# EAGLE design elm012 (EAGLE 4.16)

## Sheet 1 of 4
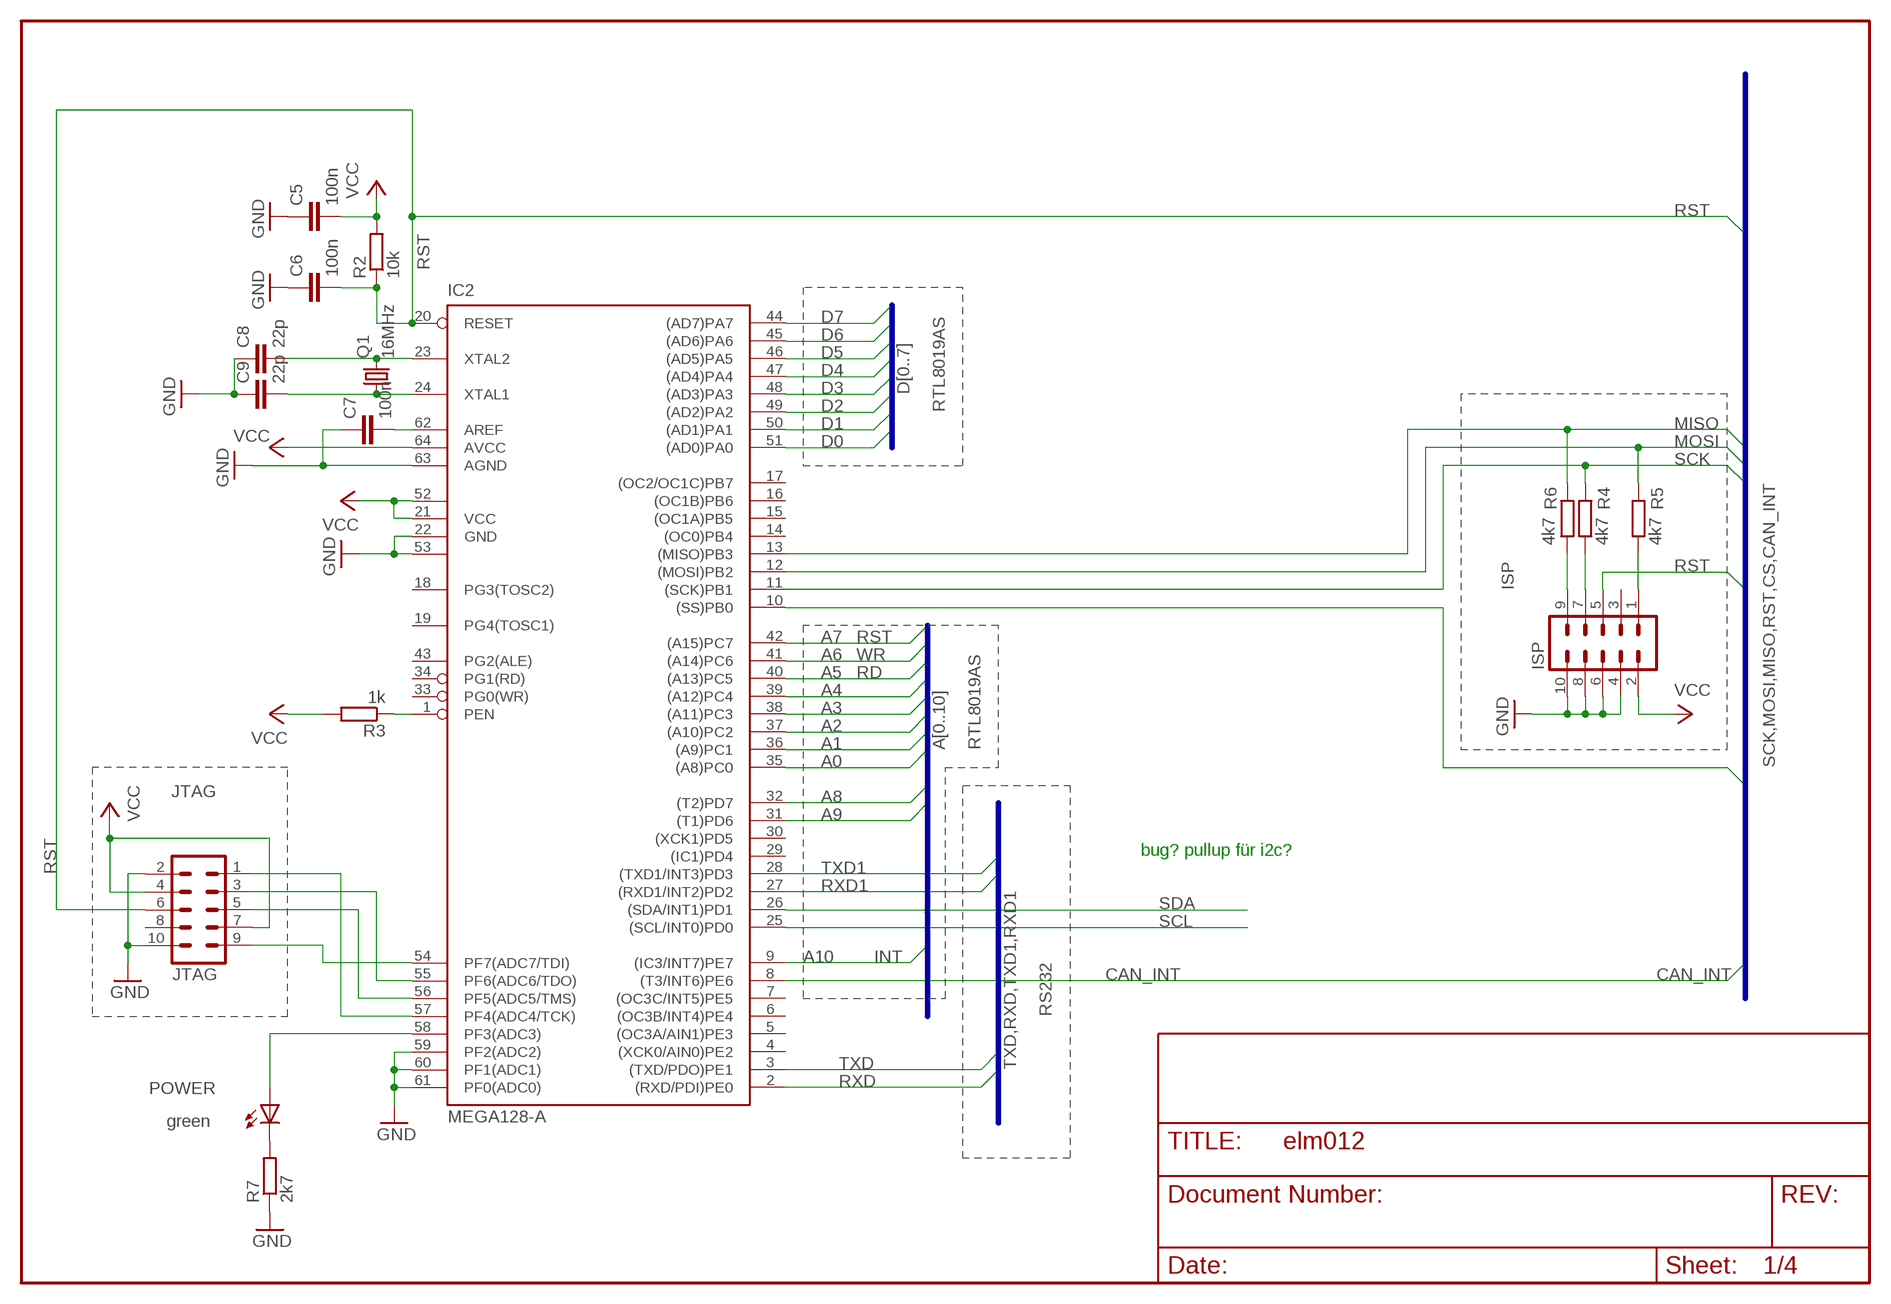
[diagram p0: schematic, sheet 1]

### Parts
C5  100n  C-EUC0603  [C0603]
C6  100n  C-EUC0603  [C0603]
C7  100n  C-EUC0603  [C0603]
C8  22p  C-EUC0603  [C0603]
C9  22p  C-EUC0603  [C0603]
IC2  MEGA128-A  [TQFP64]
ISP  MA05-2  [MA05-2]
JTAG  MA05-2  [MA05-2]
POWER  green  LED3MM  [LED3MM]
Q1  16MHz  CRYSTALHC49U-V  [HC49U-V]
R2  10k  R-EU_R0805  [R0805]
R3  1k  R-EU_R0805  [R0805]
R4  4k7  R-EU_R0805  [R0805]
R5  4k7  R-EU_R0805  [R0805]
R6  4k7  R-EU_R0805  [R0805]
R7  2k7  R-EU_R0805  [R0805]

### Nets
A0: IC2.35((A8)PC0) ; also sheet 3
A1: IC2.36((A9)PC1) ; also sheet 3
A2: IC2.37((A10)PC2) ; also sheet 3
A3: IC2.38((A11)PC3) ; also sheet 3
A4: IC2.39((A12)PC4) ; also sheet 3
A5: IC2.40((A13)PC5) ; also sheet 3
A6: IC2.41((A14)PC6) ; also sheet 3
A7: IC2.42((A15)PC7) ; also sheet 3
A8: IC2.32((T2)PD7) ; also sheet 3
A9: IC2.31((T1)PD6) ; also sheet 3
A10: IC2.9((IC3/INT7)PE7) ; also sheet 3
CAN_INT: IC2.8((T3/INT6)PE6) ; also sheet 2
CS: IC2.10((SS)PB0) ; also sheet 2
D0: IC2.51((AD0)PA0) ; also sheet 3
D1: IC2.50((AD1)PA1) ; also sheet 3
D2: IC2.49((AD2)PA2) ; also sheet 3
D3: IC2.48((AD3)PA3) ; also sheet 3
D4: IC2.47((AD4)PA4) ; also sheet 3
D5: IC2.46((AD5)PA5) ; also sheet 3
D6: IC2.45((AD6)PA6) ; also sheet 3
D7: IC2.44((AD7)PA7) ; also sheet 3
GND: C5.1 C6.1 C7.1 C8.1 C9.1 IC2.22(GND) IC2.53(GND1) IC2.59(PF2(ADC2)) IC2.60(PF1(ADC1)) IC2.61(PF0(ADC0)) IC2.63(AGND) ISP.4 ISP.6 ISP.8 ISP.10 JTAG.2 JTAG.10 R7.1 ; also sheet 2,3,4
MISO: IC2.13((MISO)PB3) R6.2 ; also sheet 2
MOSI: IC2.12((MOSI)PB2) R5.2 ; also sheet 2
N$5: C7.2 IC2.62(AREF)
N$6: C9.2 IC2.24(XTAL1) Q1.1
N$7: C8.2 IC2.23(XTAL2) Q1.2
N$22: ISP.9 R6.1
N$25: ISP.1 R5.1
N$26: IC2.1(PEN) R3.1
N$29: ISP.7 R4.1
N$31: POWER.K(C) R7.2
N$32: IC2.58(PF3(ADC3)) POWER.A
N$68: IC2.54(PF7(ADC7/TDI)) JTAG.9
N$69: IC2.55(PF6(ADC6/TDO)) JTAG.3
N$70: IC2.56(PF5(ADC5/TMS)) JTAG.5
N$71: IC2.57(PF4(ADC4/TCK)) JTAG.1
RST: C6.2 IC2.20(RESET) ISP.5 JTAG.6 R2.1 ; also sheet 2,4
RXD: IC2.2((RXD/PDI)PE0) ; also sheet 4
RXD1: IC2.27((RXD1/INT2)PD2) ; also sheet 4
SCK: IC2.11((SCK)PB1) R4.2 ; also sheet 2
SCL: IC2.25((SCL/INT0)PD0) ; also sheet 4
SDA: IC2.26((SDA/INT1)PD1) ; also sheet 4
TXD: IC2.3((TXD/PDO)PE1) ; also sheet 4
TXD1: IC2.28((TXD1/INT3)PD3) ; also sheet 4
VCC: C5.2 IC2.21(VCC) IC2.52(VCC1) IC2.64(AVCC) ISP.2 JTAG.4 JTAG.7 R2.2 R3.2 ; also sheet 2,3,4
Unconnected: IC2.4((XCK0/AIN0)PE2) IC2.5((OC3A/AIN1)PE3) IC2.6((OC3B/INT4)PE4) IC2.7((OC3C/INT5)PE5) IC2.14((OC0)PB4) IC2.15((OC1A)PB5) IC2.16((OC1B)PB6) IC2.17((OC2/OC1C)PB7) IC2.18(PG3(TOSC2)) IC2.19(PG4(TOSC1)) IC2.29((IC1)PD4) IC2.30((XCK1)PD5) IC2.33(PG0(WR)) IC2.34(PG1(RD)) IC2.43(PG2(ALE)) ISP.3 JTAG.8

### Buses
SCK,MOSI,MISO,RST,CS,CAN_INT
TXD,RXD,TXD1,RXD1
D[0..7]
A[0..10]

### Notes on the sheet
- RTL8019AS
- ISP
- RST
- WR
- RD
- RTL8019AS
- JTAG
- bug? pullup für i2c?
- INT
- RS232

## Sheet 2 of 4
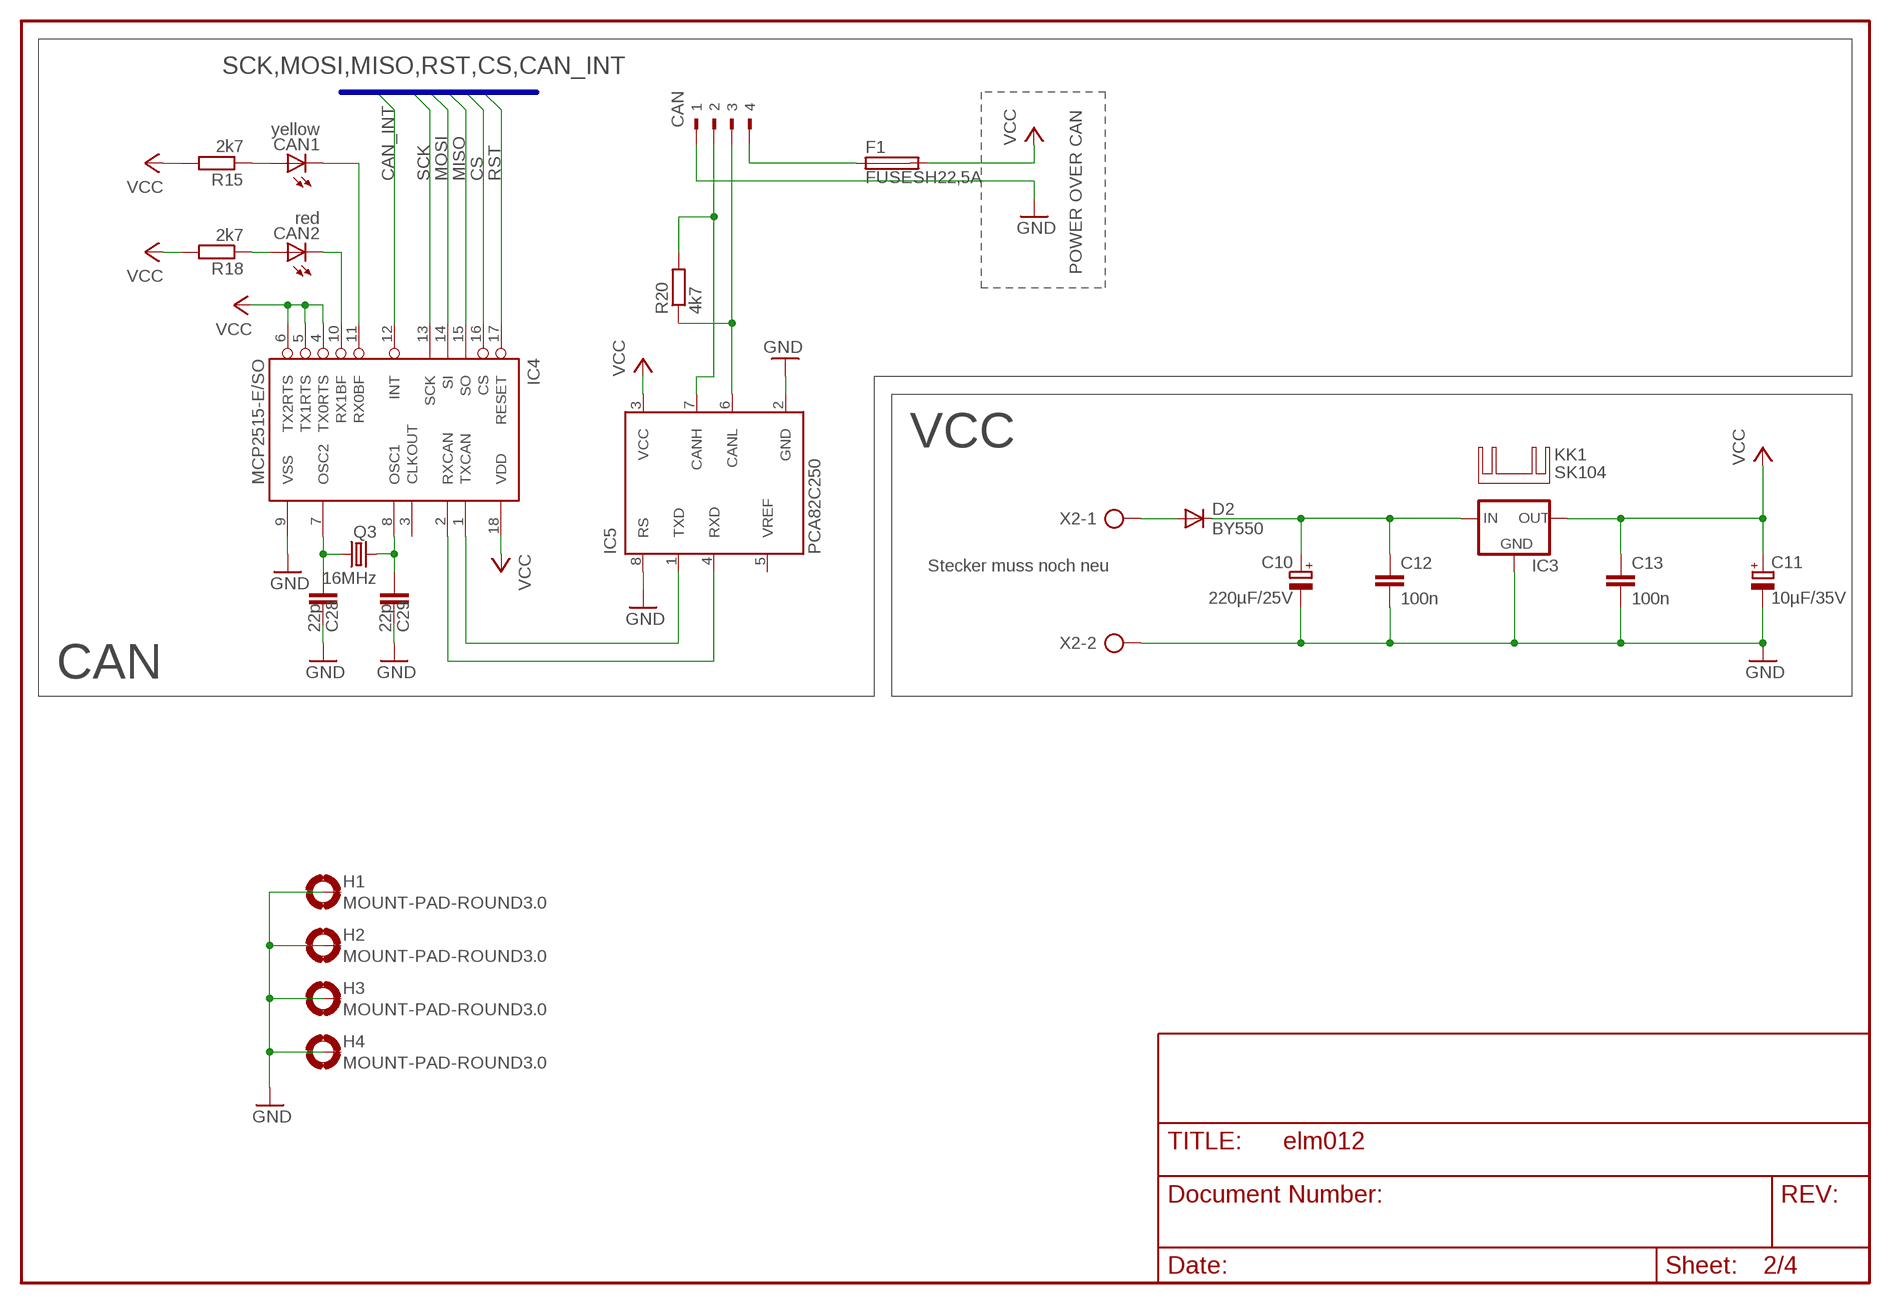
[diagram p1: schematic, sheet 2]

### Parts
C10  220µF/25V  CPOL-EUE3.5-8  [E3,5-8]
C11  10µF/35V  CPOL-EUE2-5  [E2-5]
C12  100n  C-EUC0603  [C0603]
C13  100n  C-EUC0603  [C0603]
C28  22p  C-EUC0603  [C0603]
C29  22p  C-EUC0603  [C0603]
CAN  90-4  [90-4]
CAN1  yellow  LED3MM  [LED3MM]
CAN2  red  LED3MM  [LED3MM]
D2  BY550  [DO27-15]
F1  FUSESH22,5A  [SH22,5A]
H1  MOUNT-PAD-ROUND3.0  [3,0-PAD]
H2  MOUNT-PAD-ROUND3.0  [3,0-PAD]
H3  MOUNT-PAD-ROUND3.0  [3,0-PAD]
H4  MOUNT-PAD-ROUND3.0  [3,0-PAD]
IC3  78XXS  [78XXS]
IC4  MCP2515-E/SO  [SO18L]
IC5  PCA82C250  [DIL08]
KK1  SK104  [SK104]
Q3  16MHz  CRYSTALHC49U-V  [HC49U-V]
R15  2k7  R-EU_R0805  [R0805]
R18  2k7  R-EU_R0805  [R0805]
R20  4k7  R-EU_R0805  [R0805]
X2  AK500/2-H  [AK500/2-H]

### Nets
CAN_INT: IC4.12(INT) ; also sheet 1
CS: IC4.16(CS) ; also sheet 1
GND: C10.- C11.- C12.2 C13.2 C28.2 C29.2 CAN.1 H1.B3,0(MOUNT) H2.B3,0(MOUNT) H3.B3,0(MOUNT) H4.B3,0(MOUNT) IC3.GND IC4.9(VSS) IC5.2(GND) IC5.8(RS) X2.2 ; also sheet 1,3,4
MISO: IC4.15(SO) ; also sheet 1
MOSI: IC4.14(SI) ; also sheet 1
N$2: IC4.1(TXCAN) IC5.1(TXD)
N$8: C10.+ C12.1 D2.C IC3.IN
N$10: D2.A X2.1
N$16: CAN.4 F1.1
N$21: IC4.2(RXCAN) IC5.4(RXD)
N$23: CAN.3 IC5.6(CANL) R20.1
N$27: CAN1.K(C) IC4.11(RX0BF)
N$38: CAN2.K(C) IC4.10(RX1BF)
N$48: CAN1.A R15.1
N$52: CAN2.A R18.1
N$53: C28.1 IC4.7(OSC2) Q3.1
N$54: C29.1 IC4.8(OSC1) Q3.2
N$59: CAN.2 IC5.7(CANH) R20.2
RST: IC4.17(RESET) ; also sheet 1,4
SCK: IC4.13(SCK) ; also sheet 1
VCC: C11.+ C13.1 F1.2 IC3.OUT IC4.4(TX0RTS) IC4.5(TX1RTS) IC4.6(TX2RTS) IC4.18(VDD) IC5.3(VCC) R15.2 R18.2 ; also sheet 1,3,4
Unconnected: IC4.3(CLKOUT) IC5.5(VREF)

### Buses
SCK,MOSI,MISO,RST,CS,CAN_INT

### Notes on the sheet
- POWER OVER CAN
- VCC
- Stecker muss noch neu
- CAN

## Sheet 3 of 4
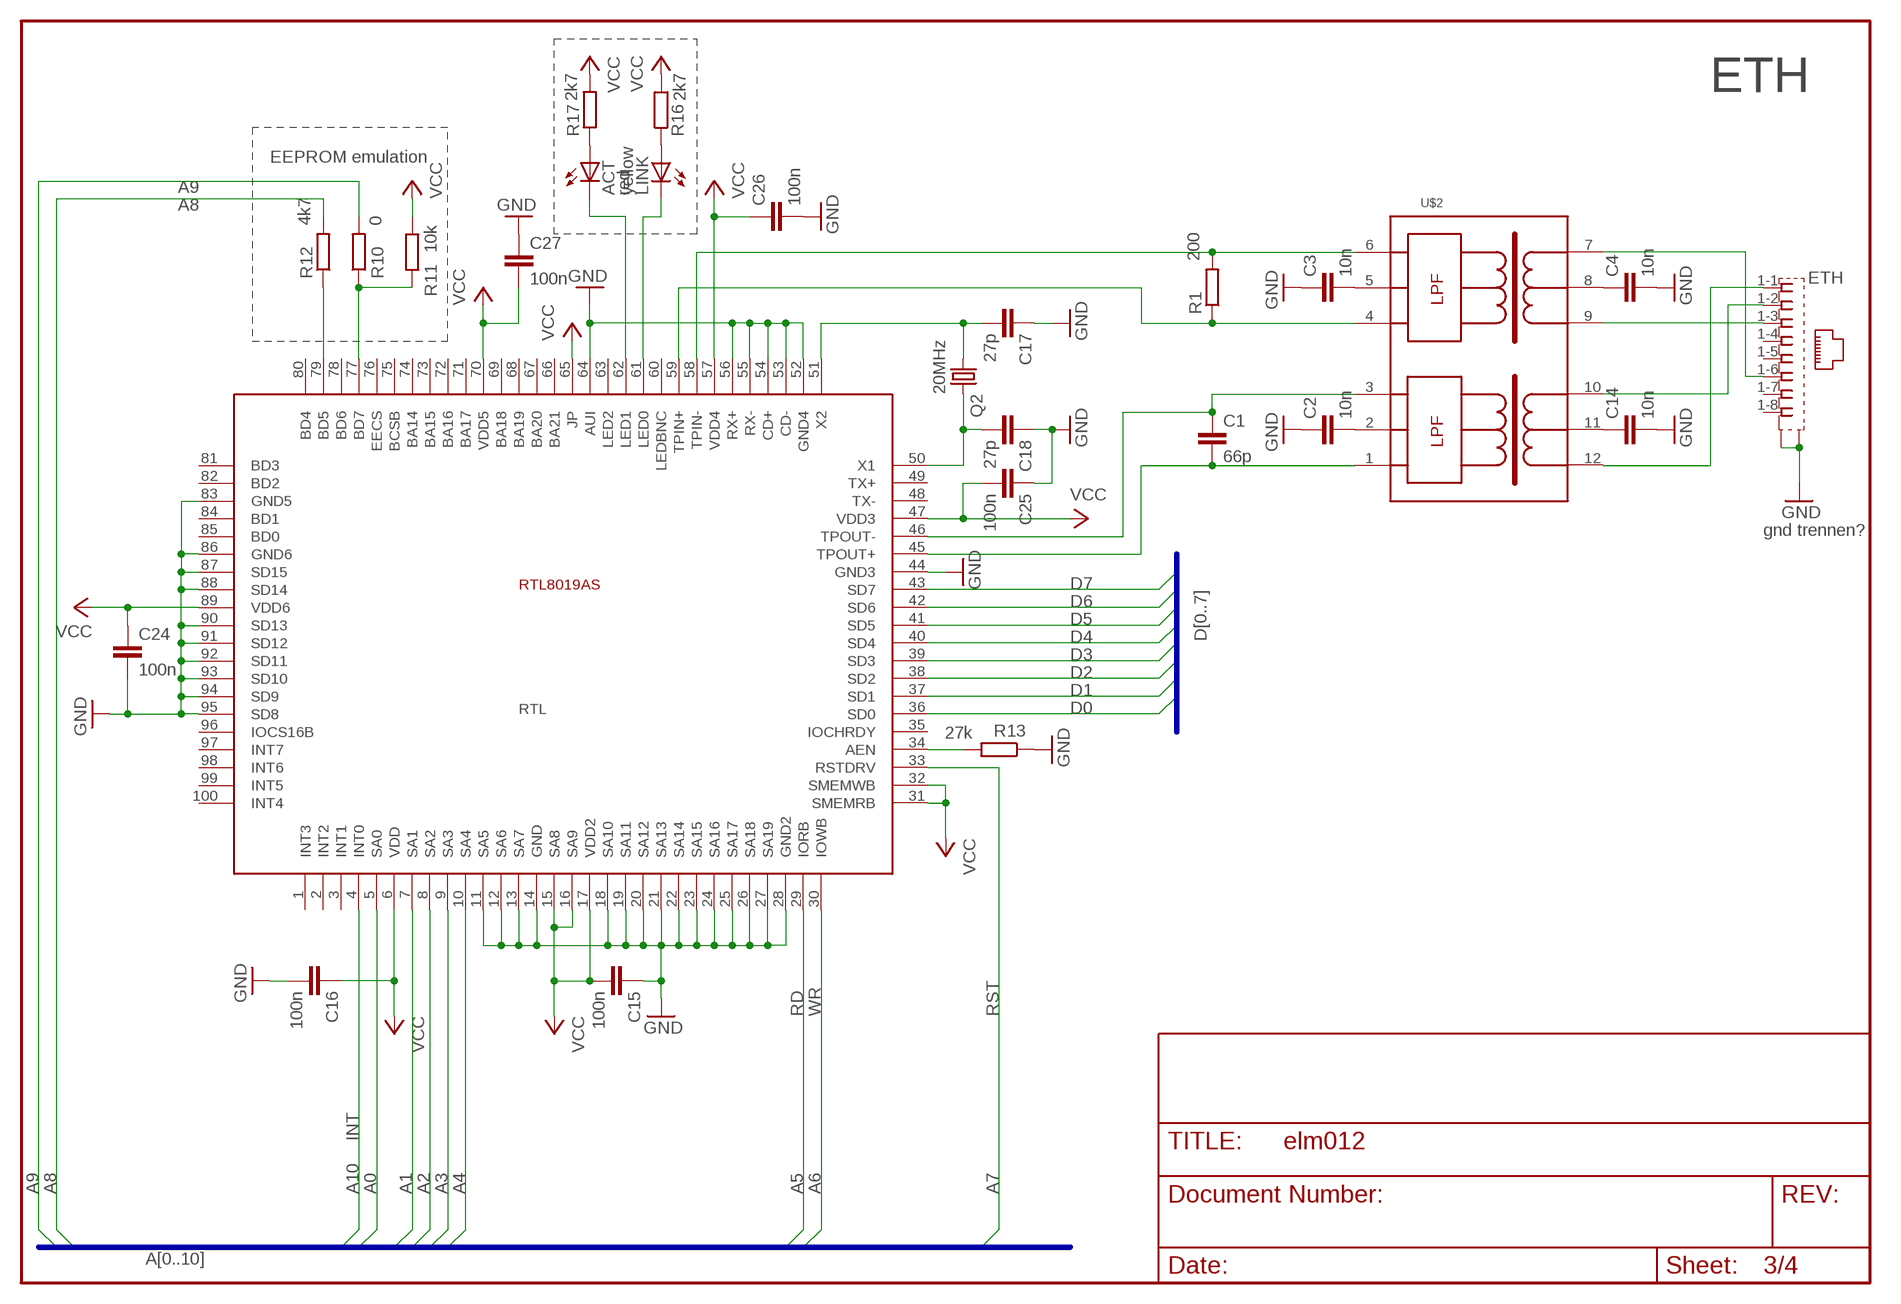
[diagram p2: schematic, sheet 3]

### Parts
ACT  red  LED3MM  [LED3MM]
C1  66p  C-EUC0603  [C0603]
C2  10n  C-EUC0603  [C0603]
C3  10n  C-EUC0603  [C0603]
C4  10n  C-EUC0603  [C0603]
C14  10n  C-EUC0603  [C0603]
C15  100n  C-EUC0603  [C0603]
C16  100n  C-EUC0603  [C0603]
C17  27p  C-EUC0603  [C0603]
C18  27p  C-EUC0603  [C0603]
C24  100n  C-EUC0603  [C0603]
C25  100n  C-EUC0603  [C0603]
C26  100n  C-EUC0603  [C0603]
C27  100n  C-EUC0603  [C0603]
ETH  557786-1  [557786-1]
LINK  yellow  LED3MM  [LED3MM]
Q2  20MHz  CRYSTALHC49U-V  [HC49U-V]
R1  200  R-EU_R0805  [R0805]
R10  0  R-EU_R0805  [R0805]
R11  10k  R-EU_R0805  [R0805]
R12  4k7  R-EU_R0805  [R0805]
R13  27k  R-EU_R0805  [R0805]
R16  2k7  R-EU_R0805  [R0805]
R17  2k7  R-EU_R0805  [R0805]
RTL  RTL8019AS  [RTL8019AS]
U$2  20F001  [DIL16/12]

### Nets
A0: RTL.5(SA0) ; also sheet 1
A1: RTL.7(SA1) ; also sheet 1
A2: RTL.8(SA2) ; also sheet 1
A3: RTL.9(SA3) ; also sheet 1
A4: RTL.10(SA4) ; also sheet 1
A5: RTL.29(IORB) ; also sheet 1
A6: RTL.30(IOWB) ; also sheet 1
A7: RTL.33(RSTDRV) ; also sheet 1
A8: R12.2 ; also sheet 1
A9: R10.2 ; also sheet 1
A10: RTL.4(INT0) ; also sheet 1
D0: RTL.36(SD0) ; also sheet 1
D1: RTL.37(SD1) ; also sheet 1
D2: RTL.38(SD2) ; also sheet 1
D3: RTL.39(SD3) ; also sheet 1
D4: RTL.40(SD4) ; also sheet 1
D5: RTL.41(SD5) ; also sheet 1
D6: RTL.42(SD6) ; also sheet 1
D7: RTL.43(SD7) ; also sheet 1
GND: C2.1 C3.1 C4.2 C14.2 C15.1 C16.2 C17.1 C18.1 C24.2 C25.1 C26.2 C27.1 ETH.G1(S2) ETH.G2(S1) R13.1 RTL.11(SA5) RTL.12(SA6) RTL.13(SA7) RTL.14(GND) RTL.18(SA10) RTL.19(SA11) RTL.20(SA12) RTL.21(SA13) RTL.22(SA14) RTL.23(SA15) RTL.24(SA16) RTL.25(SA17) RTL.26(SA18) RTL.27(SA19) RTL.28(GND2) RTL.44(GND3) RTL.52(GND4) RTL.53(CD-) RTL.54(CD+) RTL.55(RX-) RTL.56(RX+) RTL.64(AUI) RTL.83(GND5) RTL.86(GND6) RTL.87(SD15) RTL.88(SD14) RTL.90(SD13) RTL.91(SD12) RTL.92(SD11) RTL.93(SD10) RTL.94(SD9) RTL.95(SD8) ; also sheet 1,2,4
N$1: R1.2 RTL.58(TPIN-) U$2.6
N$3: R1.1 RTL.59(TPIN+) U$2.4
N$4: C1.1 RTL.46(TPOUT-) U$2.3
N$11: C1.2 RTL.45(TPOUT+) U$2.1
N$12: C3.2 U$2.5
N$13: C2.2 U$2.2
N$14: C14.1 U$2.11
N$15: C4.1 U$2.8
N$18: ETH.1-1 U$2.12
N$19: ETH.1-2 U$2.10
N$20: ETH.1-3 U$2.9
N$24: ETH.1-6 U$2.7
N$28: LINK.A R16.1
N$34: C17.2 Q2.2 RTL.51(X2)
N$35: C18.2 Q2.1 RTL.50(X1)
N$36: R10.1 R11.2 RTL.77(BD7)
N$37: R12.1 RTL.79(BD5)
N$39: R13.2 RTL.34(AEN)
N$44: ACT.A R17.1
N$45: LINK.K(C) RTL.61(LED0)
N$47: ACT.K(C) RTL.62(LED1)
VCC: C15.2 C16.1 C24.1 C25.2 C26.1 C27.2 R11.1 R16.2 R17.2 RTL.6(VDD) RTL.15(SA8) RTL.16(SA9) RTL.17(VDD2) RTL.31(SMEMRB) RTL.32(SMEMWB) RTL.47(VDD3) RTL.57(VDD4) RTL.65(JP) RTL.70(VDD5) RTL.89(VDD6) ; also sheet 1,2,4
Unconnected: ETH.1-4 ETH.1-5 ETH.1-7 ETH.1-8 RTL.1(INT3) RTL.2(INT2) RTL.3(INT1) RTL.35(IOCHRDY) RTL.48(TX-) RTL.49(TX+) RTL.60(LEDBNC) RTL.63(LED2) RTL.66(BA21) RTL.67(BA20) RTL.68(BA19) RTL.69(BA18) RTL.71(BA17) RTL.72(BA16) RTL.73(BA15) RTL.74(BA14) RTL.75(BCSB) RTL.76(EECS) RTL.78(BD6) RTL.80(BD4) RTL.81(BD3) RTL.82(BD2) RTL.84(BD1) RTL.85(BD0) RTL.96(IOCS16B) RTL.97(INT7) RTL.98(INT6) RTL.99(INT5) RTL.100(INT4)

### Buses
D[0..7]
A[0..10]

### Notes on the sheet
- ETH
- EEPROM emulation
- gnd trennen?
- RD | WR | RST
- INT

## Sheet 4 of 4
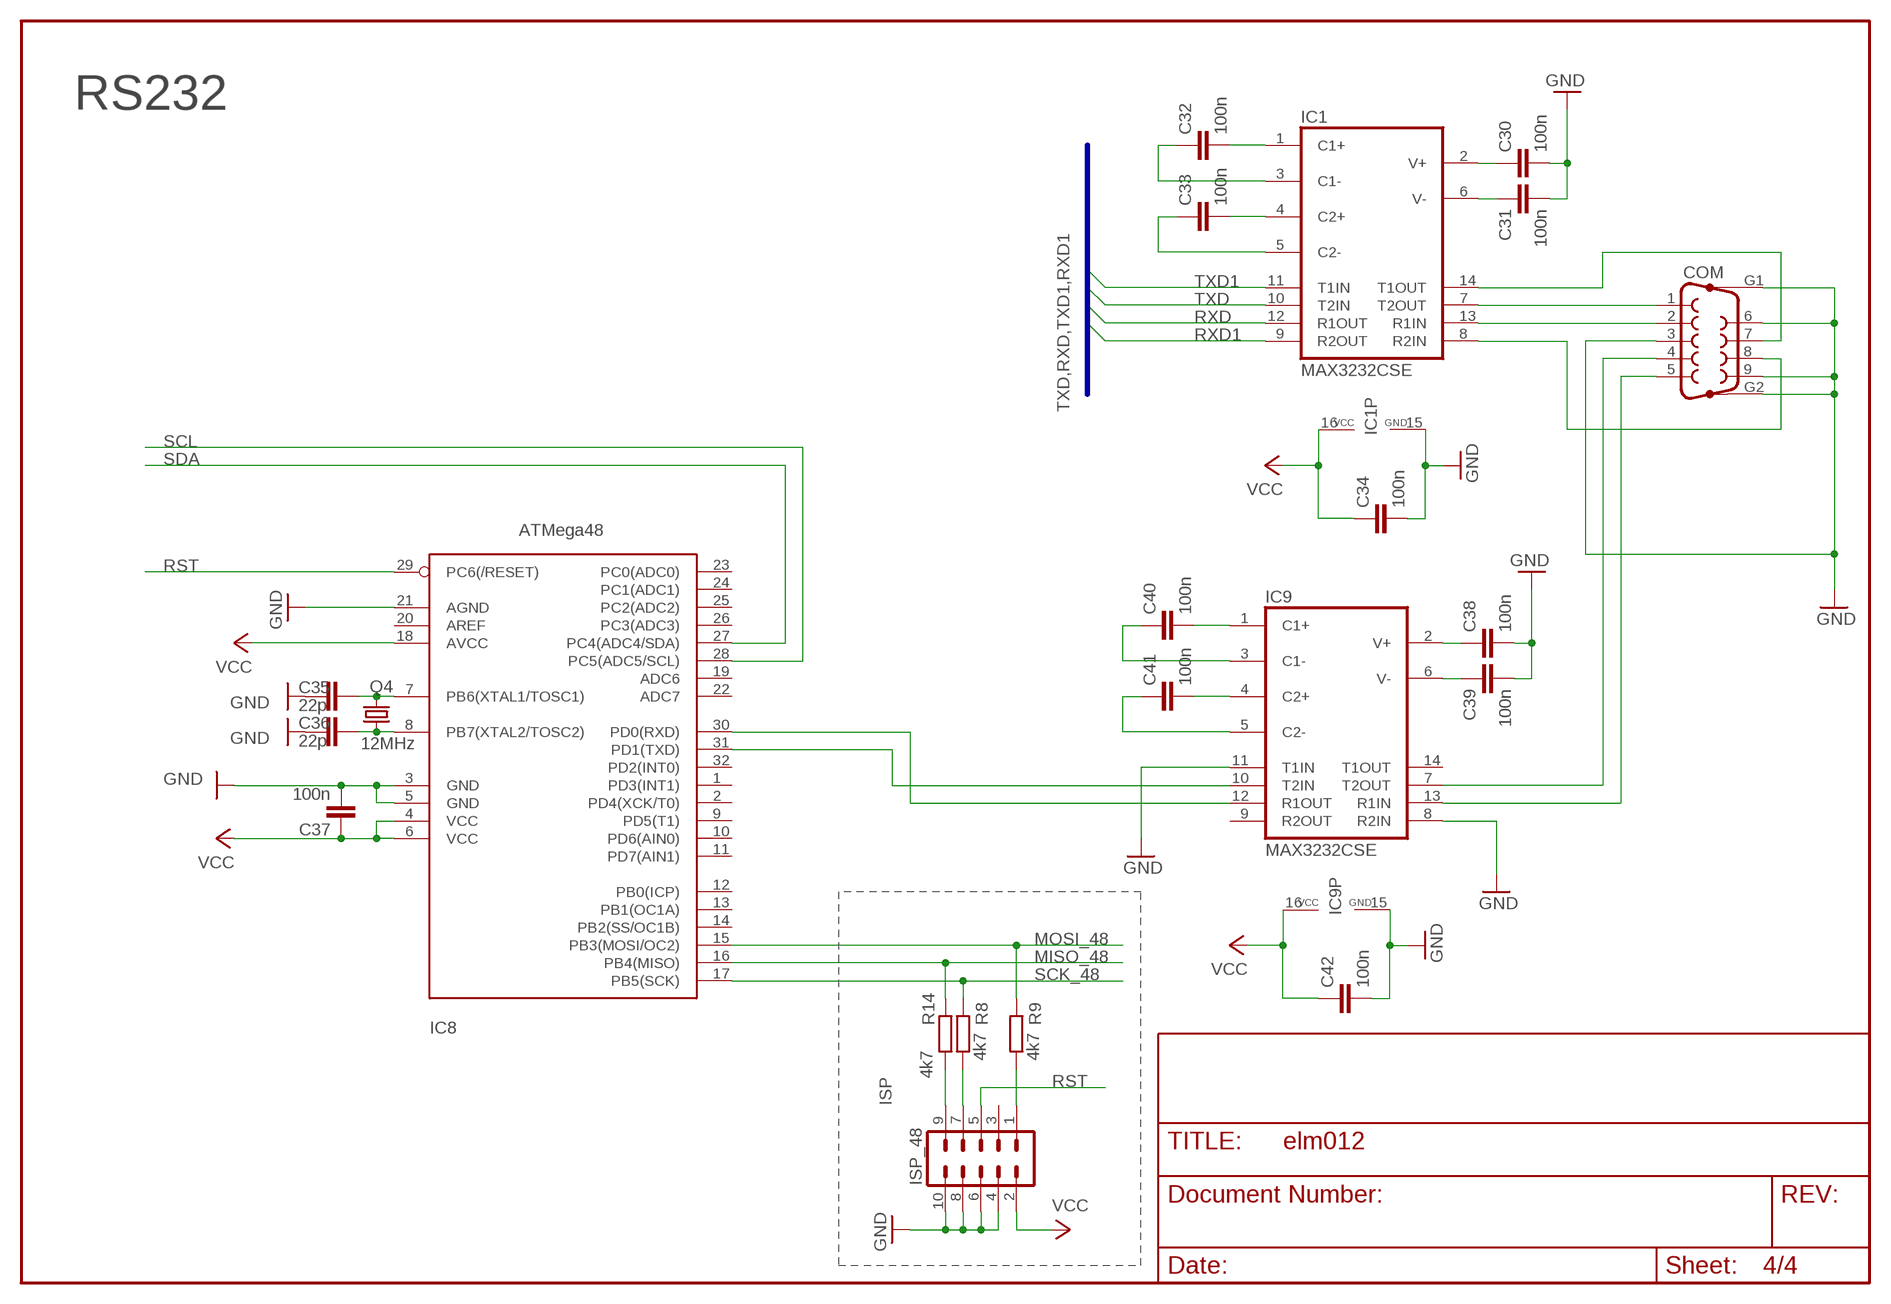
[diagram p3: schematic, sheet 4]

### Parts
C30  100n  C-EUC0603  [C0603]
C31  100n  C-EUC0603  [C0603]
C32  100n  C-EUC0603  [C0603]
C33  100n  C-EUC0603  [C0603]
C34  100n  C-EUC0603  [C0603]
C35  22p  C-EUC0603  [C0603]
C36  22p  C-EUC0603  [C0603]
C37  100n  C-EUC0603  [C0603]
C38  100n  C-EUC0603  [C0603]
C39  100n  C-EUC0603  [C0603]
C40  100n  C-EUC0603  [C0603]
C41  100n  C-EUC0603  [C0603]
C42  100n  C-EUC0603  [C0603]
COM  F09HP  [F09HP]
IC1  MAX3232CSE  [SO16]
IC8  ATMega48  MEGA8-AI  [TQFP32-08]
IC9  MAX3232CSE  [SO16]
ISP_48  MA05-2  [MA05-2]
Q4  12MHz  CRYTALHC49S  [HC49/S]
R8  4k7  R-EU_R0805  [R0805]
R9  4k7  R-EU_R0805  [R0805]
R14  4k7  R-EU_R0805  [R0805]

### Nets
GND: C30.2 C31.2 C34.2 C35.1 C36.2 C37.2 C38.2 C39.2 C42.2 COM.3 COM.6 COM.9 COM.G1 COM.G2 IC1.15(GND) IC8.3(GND) IC8.5(GND) IC8.21(AGND) IC9.8(R2IN) IC9.11(T1IN) IC9.15(GND) ISP_48.4 ISP_48.6 ISP_48.8 ISP_48.10 ; also sheet 1,2,3
MISO_48: IC8.16(PB4(MISO)) R14.2
MOSI_48: IC8.15(PB3(MOSI/OC2)) R9.2
N$9: COM.1 IC1.7(T2OUT)
N$17: ISP_48.9 R14.1
N$30: ISP_48.1 R9.1
N$33: COM.2 IC1.13(R1IN)
N$40: ISP_48.7 R8.1
N$60: C32.2 IC1.1(C1+)
N$61: C33.2 IC1.4(C2+)
N$72: C33.1 IC1.5(C2-)
N$73: C32.1 IC1.3(C1-)
N$74: COM.7 IC1.14(T1OUT)
N$75: COM.8 IC1.8(R2IN)
N$76: C30.1 IC1.2(V+)
N$77: C31.1 IC1.6(V-)
N$78: COM.4 IC9.7(T2OUT)
N$79: C35.2 IC8.7(PB6(XTAL1/TOSC1)) Q4.2
N$80: C36.1 IC8.8(PB7(XTAL2/TOSC2)) Q4.1
N$82: COM.5 IC9.13(R1IN)
N$83: C40.2 IC9.1(C1+)
N$84: C41.2 IC9.4(C2+)
N$85: C41.1 IC9.5(C2-)
N$86: C40.1 IC9.3(C1-)
N$87: IC8.30(PD0(RXD)) IC9.12(R1OUT)
N$88: IC8.31(PD1(TXD)) IC9.10(T2IN)
N$89: C38.1 IC9.2(V+)
N$90: C39.1 IC9.6(V-)
RST: IC8.29(PC6(/RESET)) ISP_48.5 ; also sheet 1,2
RXD: IC1.12(R1OUT) ; also sheet 1
RXD1: IC1.9(R2OUT) ; also sheet 1
SCK_48: IC8.17(PB5(SCK)) R8.2
SCL: IC8.28(PC5(ADC5/SCL)) ; also sheet 1
SDA: IC8.27(PC4(ADC4/SDA)) ; also sheet 1
TXD: IC1.10(T2IN) ; also sheet 1
TXD1: IC1.11(T1IN) ; also sheet 1
VCC: C34.1 C37.1 C42.1 IC1.16(VCC) IC8.4(VCC) IC8.6(VCC) IC8.18(AVCC) IC9.16(VCC) ISP_48.2 ; also sheet 1,2,3
Unconnected: IC8.1(PD3(INT1)) IC8.2(PD4(XCK/T0)) IC8.9(PD5(T1)) IC8.10(PD6(AIN0)) IC8.11(PD7(AIN1)) IC8.12(PB0(ICP)) IC8.13(PB1(OC1A)) IC8.14(PB2(SS/OC1B)) IC8.19(ADC6) IC8.20(AREF) IC8.22(ADC7) IC8.23(PC0(ADC0)) IC8.24(PC1(ADC1)) IC8.25(PC2(ADC2)) IC8.26(PC3(ADC3)) IC8.32(PD2(INT0)) IC9.9(R2OUT) IC9.14(T1OUT) ISP_48.3

### Buses
TXD,RXD,TXD1,RXD1

### Notes on the sheet
- RS232
- ISP

## Library data of the parts
ACT CAN1 CAN2 LINK POWER = led:LED: LED OSRAM: - CHIPLED LG R971, LG N971, LY N971, LG Q971, LY Q971, LO R971, LY R971 LH N974, LH R974 LS Q976, LO Q976, LY Q976 LO Q996 - Hyper CHIPLED LW Q18S LB Q993, LB Q99A, LB R99A - SideLED LS A670, LO A670, LY A670, LG A670, LP A670 LB A673, LV A673, LT A673, LW A673 LH A674 LY A675 LS A676, LA A676, LO A676, LY A676, LW A676 LS A679, LY A679, LG A679 - Hyper Micro SIDELED® LS Y876, LA Y876, LO Y876, LY Y876 LT Y87S - SmartLED LW L88C, LW L88S LB L89C, LB L89S, LG L890 LS L89K, LO L89K, LY L89K LS L896, LA L896, LO L896, LY L896 - TOPLED LS T670, LO T670, LY T670, LG T670, LP T670 LSG T670, LSP T670, LSY T670, LOP T670, LYG T670 LG T671, LOG T671, LSG T671 LB T673, LV T673, LT T673, LW T673 LH T674 LS T676, LA T676, LO T676, LY T676, LB T676, LH T676, LSB T676, LW T676 LB T67C, LV T67C, LT T67C, LS T67K, LO T67K, LY T67K, LW E67C LS E67B, LA E67B, LO E67B, LY E67B, LB E67C, LV E67C, LT E67C LW T67C LS T679, LY T679, LG T679 LS T770, LO T770, LY T770, LG T770, LP T770 LB T773, LV T773, LT T773, LW T773 LH T774 LS E675, LA E675, LY E675, LS T675 LS T776, LA T776, LO T776, LY T776, LB T776 LHGB T686 LT T68C, LB T68C - Hyper Mini TOPLED® LB M676 - Mini TOPLED Santana® LG M470 LS M47K, LO M47K, LY M47K Source: http://www.osram.convergy.de - LUMILED® LXK2-PW12-R00, LXK2-PW12-S00, LXK2-PW14-U00, LXK2-PW14-V00 LXK2-PM12-R00, LXK2-PM12-S00, LXK2-PM14-U00 LXK2-PE12-Q00, LXK2-PE12-R00, LXK2-PE12-S00, LXK2-PE14-T00, LXK2-PE14-U00 LXK2-PB12-K00, LXK2-PB12-L00, LXK2-PB12-M00, LXK2-PB14-N00, LXK2-PB14-P00, LXK2-PB14-Q00 LXK2-PR12-L00, LXK2-PR12-M00, LXK2-PR14-Q00, LXK2-PR14-R00 LXK2-PD12-Q00, LXK2-PD12-R00, LXK2-PD12-S00 LXK2-PH12-R00, LXK2-PH12-S00 LXK2-PL12-P00, LXK2-PL12-Q00, LXK2-PL12-R00 Source: www.luxeon.com
C1-C9 C12-C18 C24-C42 = rcl:C-EU: CAPACITOR, European symbol
C10 C11 = rcl:CPOL-EU: POLARIZED CAPACITOR, European symbol
CAN = con-weidmueller-sl35:90-4: WEIDMUELLER CLAMP CONNECTOR
COM = con-subd:F09HP: SUB-D
D2 = diode:BY550: DIODE Si200 V, 5 A
ETH = con-amp:557786-1: AMP connector
F1 = fuse:FUSE: Fuse
H1-H4 = holes:MOUNT-PAD-ROUND: MOUNTING PAD, round
IC1 IC9 = maxim:MAX3232*: True RS-232 Transceivers 3.0V to 5.5V, Low-Power up to 1Mbps, Using Four 0.1µF External Capacitors Source: http://pdfserv.maxim-ic.com/en/ds/MAX3222-MAX3241.pdf
IC2 = atmel:MEGA128: MICROCONTROLLER 128 Kbytes FLASH 4 Kbytes SRAM 4 Kbytes EEPROM DUAL USART 8-channel 10 bit ADC Source: avr.lbr
IC3 = v-reg:78XXS: VOLTAGE REGULATOR
IC4 = mcp2515:MCP2515
IC5 = micro-philips:PCA82C250: CAN CONTROLLER INTERFACE
IC8 = atmel:MEGA8: MICROCONTROLLER 8 Kbytes FLASH 1 kbytes SRAM 512 bytes EEPROM USART 6-channel 10 bit ADC 2-channel 8 bit ADC Source: avr.lbr
ISP ISP_48 JTAG = con-lstb:MA05-2: PIN HEADER
KK1 = heatsink:SK104: HEATSINK manufacturer Fischer/distributor Buerklin
Q1-Q3 = crystal:CRYSTAL: CRYSTAL
Q4 = crystal:CRYTAL: CRYSTAL
R1-R18 R20 = rcl:R-EU_: RESISTOR, European symbol
RTL = rtl8019as:RTL8019AS
U$2 = Realtek:20F001
X2 = con-ptr500:AK500/2-H: CONNECTOR Aug. 2004 / PTR Meßtechnik: Die Bezeichnung der Serie AK505 wurde geändert. Es handelt sich hierbei um AK500 in horizontaler Ausführung.

## Board
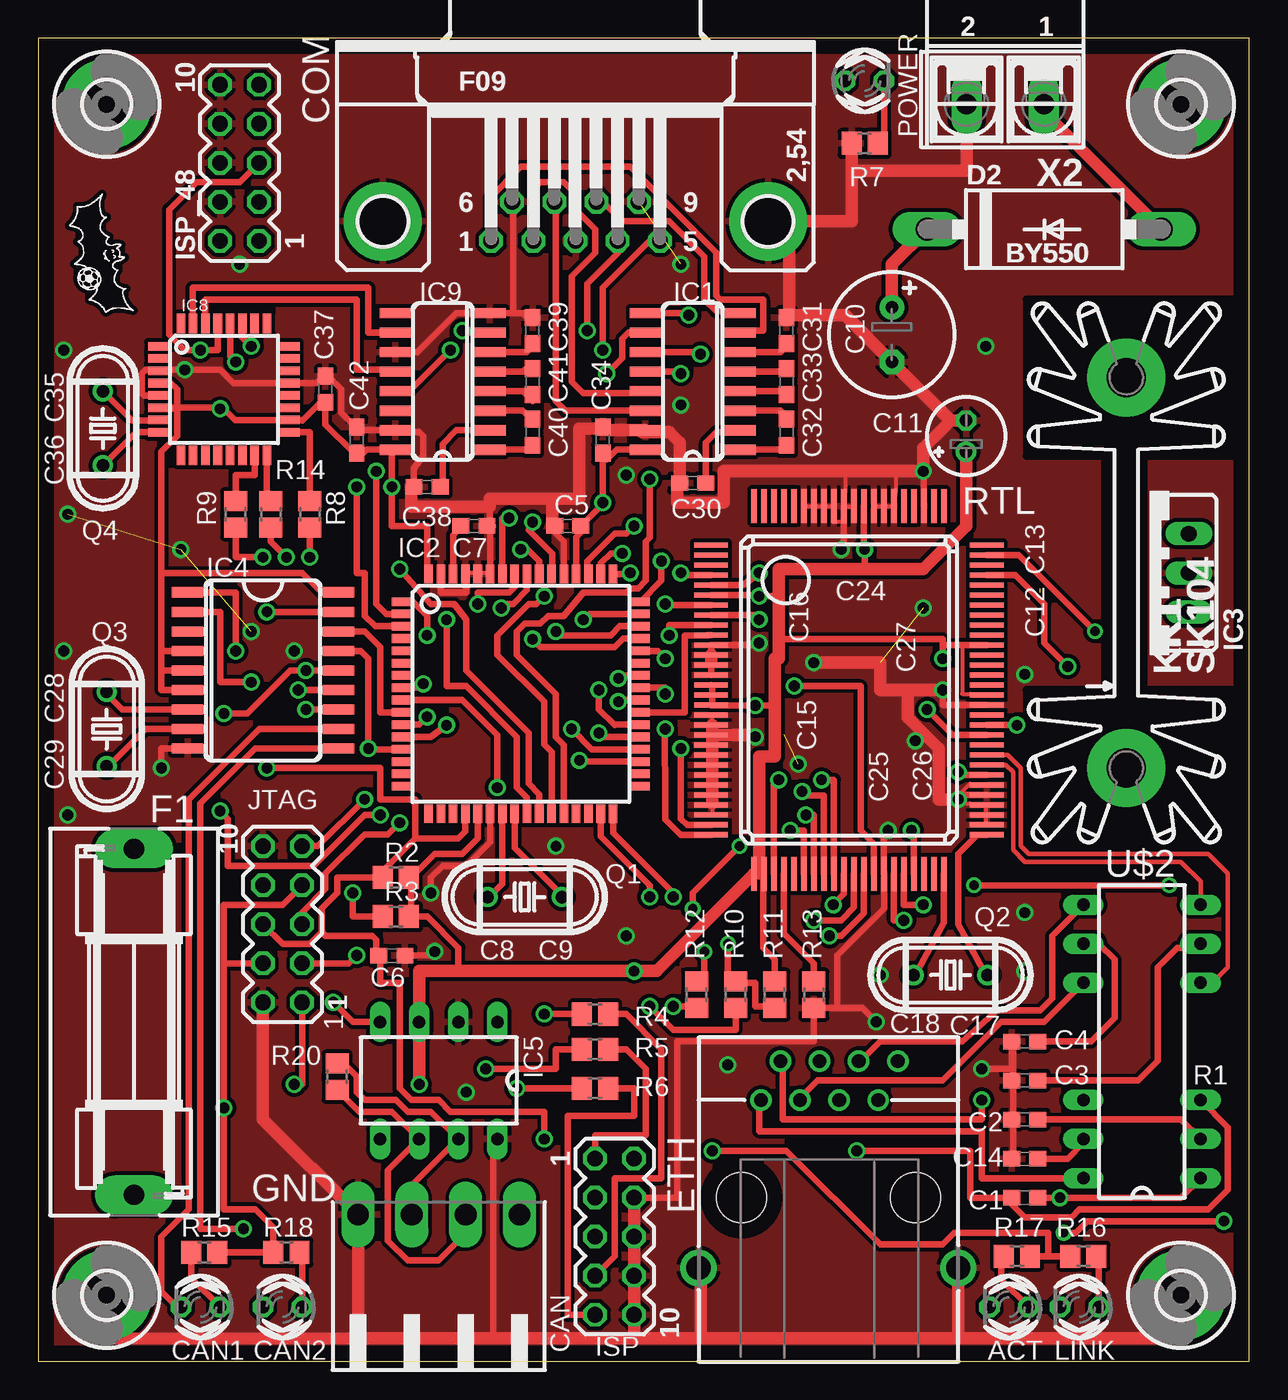
[diagram p4: board, top side]
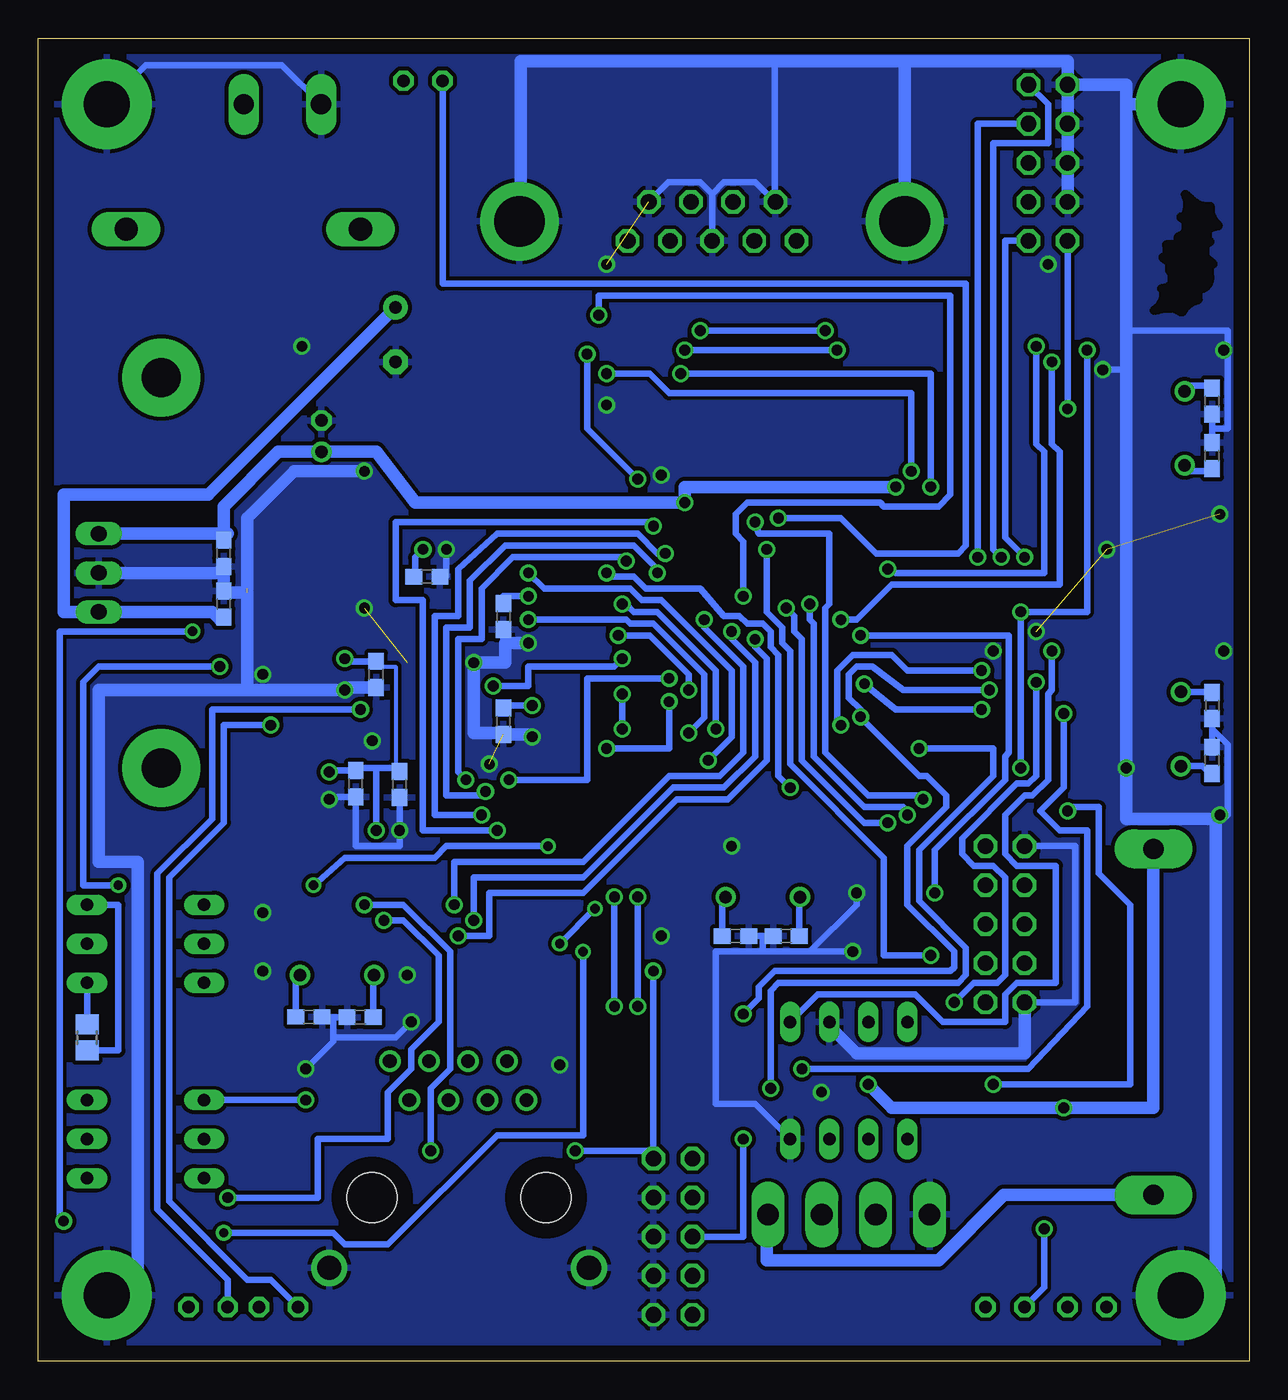
[diagram p5: board, bottom side, seen from below]

Size 78.72 x 86.03 mm. Coordinates in mm from the lower left corner, seen from the top.
Outline: 0,0 78.72,0 78.72,86.03 0,86.03 0,0
Copper layers (1*16): Top 0.035mm / dielectric 1.5mm / Bottom 0.035mm
Design rules "olimex_8mils": minimum track width 10mil, minimum drill 24mil, track to track 8mil, track to pad 8mil, pad to pad 8mil, via to via 8mil, smd to smd 8mil, copper to edge 40mil, drill to drill 10mil, minimum pad ring 10mil, minimum via ring 8mil, stop-mask expansion 0mil, vias tented up to drill 0mil, thermal gap 10mil
tRestrict: area 2,73.8 to 2,73.9; area 2,73.8 to 2,73.9; area 2,73.8 to 2.1,73.9; area 2.1,73.8 to 2.1,74; area 2.1,73.9 to 2.1,74; area 2.1,73.8 to 2.1,73.9; area 2.1,73.9 to 2.1,74; area 2.1,73.8 to 2.1,73.9; area 2.1,73.9 to 2.2,74; area 2.1,73.8 to 2.2,73.9; area 2.2,74 to 2.2,74.1; area 2.2,73.8 to 2.2,73.8; 797 more areas
bRestrict: area 2,73.8 to 2,73.9; area 2,73.8 to 2,73.9; area 2,73.8 to 2.1,73.9; area 2.1,73.8 to 2.1,74; area 2.1,73.9 to 2.1,74; area 2.1,73.8 to 2.1,73.9; area 2.1,73.9 to 2.1,74; area 2.1,73.8 to 2.1,73.9; area 2.1,73.9 to 2.2,74; area 2.1,73.8 to 2.2,73.9; area 2.2,74 to 2.2,74.1; area 2.2,73.8 to 2.2,73.8; 797 more areas

### Footprints (pad centres in the part's own frame; a part is rotated, then mirrored left to right if it is on the bottom)
LED3MM = drill 0.813 octagon: A -1.27,0; K 1.27,0
C0603 = smd 1.1 x 1: 1 -0.85,0; 2 0.85,0
E3,5-8 = drill 0.813 pad 1.6 round: + -1.778,0 | drill 0.813 pad 1.6 octagon: - 1.778,0
E2-5 = drill 0.813 pad 1.27 round: + -1.016,0 | drill 0.813 pad 1.27 octagon: - 1.016,0
90-4 = drill 1.422 long: 1 -5.25,5.25; 2 -1.75,5.25; 3 1.75,5.25; 4 5.25,5.25
F09HP = drill 1.016 octagon: 1 -5.486,-1.27; 2 -2.743,-1.27; 3 0,-1.27; 4 2.743,-1.27; 5 5.486,-1.27; 6 -4.115,1.27; 7 -1.372,1.27; 8 1.372,1.27; 9 4.115,1.27 | drill 3.302 pad 5.08 round: G1 -12.522,0; G2 12.522,0
DO27-15 = drill 1.499 long: A 7.62,0; C -7.62,0
557786-1 = drill 0.889 round: 1-1 -4.445,6.35; 1-2 -3.175,8.89; 1-3 -1.905,6.35; 1-4 -0.635,8.89; 1-5 0.635,6.35; 1-6 1.905,8.89; 1-7 3.175,6.35; 1-8 4.445,8.89 | drill 1.575 pad 2.184 round: G1 -8.509,-4.572; G2 8.382,-4.572 | hole 3.251: -5.715,0; 5.588,0
SH22,5A = drill 1.321 pad 2.54 long: 1 -11.252,0; 2 11.252,0
3,0-PAD = drill 3 pad 5.842 round: B3,0 0,0
SO16 = smd 0.66 x 2.032: 1 -4.445,-3.073; 2 -3.175,-3.073; 3 -1.905,-3.073; 4 -0.635,-3.073; 5 0.635,-3.073; 6 1.905,-3.073; 7 3.175,-3.073; 8 4.445,-3.073; 9 4.445,3.073; 10 3.175,3.073; 11 1.905,3.073; 12 0.635,3.073; 13 -0.635,3.073; 14 -1.905,3.073; 15 -3.175,3.073; 16 -4.445,3.073
TQFP64 = smd 1.194 x 0.559: 1 -7.8,6; 2 -7.8,5.2; 3 -7.8,4.4; 4 -7.8,3.6; 5 -7.8,2.8; 6 -7.8,2; 7 -7.8,1.2; 8 -7.8,0.4; 9 -7.8,-0.4; 10 -7.8,-1.2; 11 -7.8,-2; 12 -7.8,-2.8; 13 -7.8,-3.6; 14 -7.8,-4.4; 15 -7.8,-5.2; 16 -7.8,-6; 33 7.8,-6; 34 7.8,-5.2; 35 7.8,-4.4; 36 7.8,-3.6; 37 7.8,-2.8; 38 7.8,-2; 39 7.8,-1.2; 40 7.8,-0.4; 41 7.8,0.4; 42 7.8,1.2; 43 7.8,2; 44 7.8,2.8; 45 7.8,3.6; 46 7.8,4.4; 47 7.8,5.2; 48 7.8,6 | smd 0.559 x 1.194: 17 -6,-7.8; 18 -5.2,-7.8; 19 -4.4,-7.8; 20 -3.6,-7.8; 21 -2.8,-7.8; 22 -2,-7.8; 23 -1.2,-7.8; 24 -0.4,-7.8; 25 0.4,-7.8; 26 1.2,-7.8; 27 2,-7.8; 28 2.8,-7.8; 29 3.6,-7.8; 30 4.4,-7.8; 31 5.2,-7.8; 32 6,-7.8; 49 6,7.8; 50 5.2,7.8; 51 4.4,7.8; 52 3.6,7.8; 53 2.8,7.8; 54 2,7.8; 55 1.2,7.8; 56 0.4,7.8; 57 -0.4,7.8; 58 -1.2,7.8; 59 -2,7.8; 60 -2.8,7.8; 61 -3.6,7.8; 62 -4.4,7.8; 63 -5.2,7.8; 64 -6,7.8
78XXS = drill 1.016 long: GND 0,-2.54; IN -2.54,-2.54; OUT 2.54,-2.54
SO18L = smd 0.66 x 2.032: 1 -5.08,-4.902; 2 -3.81,-4.902; 3 -2.54,-4.902; 4 -1.27,-4.902; 5 0,-4.902; 6 1.27,-4.902; 7 2.54,-4.902; 8 3.81,-4.902; 9 5.08,-4.902; 10 5.08,4.902; 11 3.81,4.902; 12 2.54,4.902; 13 1.27,4.902; 14 0,4.902; 15 -1.27,4.902; 16 -2.54,4.902; 17 -3.81,4.902; 18 -5.08,4.902
DIL08 = drill 0.813 long: 1 -3.81,-3.81; 2 -1.27,-3.81; 3 1.27,-3.81; 4 3.81,-3.81; 5 3.81,3.81; 6 1.27,3.81; 7 -1.27,3.81; 8 -3.81,3.81
TQFP32-08 = smd 1.27 x 0.559: 1 -4.293,2.8; 2 -4.293,2; 3 -4.293,1.2; 4 -4.293,0.4; 5 -4.293,-0.4; 6 -4.293,-1.2; 7 -4.293,-2; 8 -4.293,-2.8; 17 4.293,-2.8; 18 4.293,-2; 19 4.293,-1.2; 20 4.293,-0.4; 21 4.293,0.4; 22 4.293,1.2; 23 4.293,2; 24 4.293,2.8 | smd 0.559 x 1.27: 9 -2.8,-4.293; 10 -2,-4.293; 11 -1.2,-4.293; 12 -0.4,-4.293; 13 0.4,-4.293; 14 1.2,-4.293; 15 2,-4.293; 16 2.8,-4.293; 25 2.8,4.293; 26 2,4.293; 27 1.2,4.293; 28 0.4,4.293; 29 -0.4,4.293; 30 -1.2,4.293; 31 -2,4.293; 32 -2.8,4.293
MA05-2 = drill 1.016 octagon: 1 -5.08,-1.27; 2 -5.08,1.27; 3 -2.54,-1.27; 4 -2.54,1.27; 5 0,-1.27; 6 0,1.27; 7 2.54,-1.27; 8 2.54,1.27; 9 5.08,-1.27; 10 5.08,1.27
SK104 = drill 2.54 pad 5.08 round: A2,5 -12.7,-0.762; B2,5 12.7,-0.762
HC49U-V = drill 0.813 round: 1 -2.413,0; 2 2.413,0
HC49/S = drill 0.813 round: 1 -2.413,0; 2 2.413,0
R0805 = smd 1.3 x 1.5: 1 -0.85,0; 2 0.85,0
RTL8019AS = smd 0.35 x 2.2: 1 -9.425,-8.965; 2 -8.775,-8.965; 3 -8.125,-8.965; 4 -7.475,-8.965; 5 -6.825,-8.965; 6 -6.175,-8.965; 7 -5.525,-8.965; 8 -4.875,-8.965; 9 -4.225,-8.965; 10 -3.575,-8.965; 11 -2.925,-8.965; 12 -2.275,-8.965; 13 -1.625,-8.965; 14 -0.975,-8.965; 15 -0.325,-8.965; 16 0.325,-8.965; 17 0.975,-8.965; 18 1.625,-8.965; 19 2.275,-8.965; 20 2.925,-8.965; 21 3.575,-8.965; 22 4.225,-8.965; 23 4.875,-8.965; 24 5.525,-8.965; 25 6.175,-8.965; 26 6.825,-8.965; 27 7.475,-8.965; 28 8.125,-8.965; 29 8.775,-8.965; 30 9.425,-8.965; 51 9.425,8.965; 52 8.775,8.965; 53 8.125,8.965; 54 7.475,8.965; 55 6.825,8.965; 56 6.175,8.965; 57 5.525,8.965; 58 4.875,8.965; 59 4.225,8.965; 60 3.575,8.965; 61 2.925,8.965; 62 2.275,8.965; 63 1.625,8.965; 64 0.975,8.965; 65 0.325,8.965; 66 -0.325,8.965; 67 -0.975,8.965; 68 -1.625,8.965; 69 -2.275,8.965; 70 -2.925,8.965; 71 -3.575,8.965; 72 -4.225,8.965; 73 -4.875,8.965; 74 -5.525,8.965; 75 -6.175,8.965; 76 -6.825,8.965; 77 -7.475,8.965; 78 -8.125,8.965; 79 -8.775,8.965; 80 -9.425,8.965 | smd 2.2 x 0.35: 31 11.965,-6.175; 32 11.965,-5.525; 33 11.965,-4.875; 34 11.965,-4.225; 35 11.965,-3.575; 36 11.965,-2.925; 37 11.965,-2.275; 38 11.965,-1.625; 39 11.965,-0.975; 40 11.965,-0.325; 41 11.965,0.325; 42 11.965,0.975; 43 11.965,1.625; 44 11.965,2.275; 45 11.965,2.925; 46 11.965,3.575; 47 11.965,4.225; 48 11.965,4.875; 49 11.965,5.525; 50 11.965,6.175; 81 -11.965,6.175; 82 -11.965,5.525; 83 -11.965,4.875; 84 -11.965,4.225; 85 -11.965,3.575; 86 -11.965,2.925; 87 -11.965,2.275; 88 -11.965,1.625; 89 -11.965,0.975; 90 -11.965,0.325; 91 -11.965,-0.325; 92 -11.965,-0.975; 93 -11.965,-1.625; 94 -11.965,-2.275; 95 -11.965,-2.925; 96 -11.965,-3.575; 97 -11.965,-4.225; 98 -11.965,-4.875; 99 -11.965,-5.525; 100 -11.965,-6.175
DIL16/12 = drill 0.813 long: 1 -8.89,-3.81; 2 -6.35,-3.81; 3 -3.81,-3.81; 4 3.81,-3.81; 5 6.35,-3.81; 6 8.89,-3.81; 7 8.89,3.81; 8 6.35,3.81; 9 3.81,3.81; 10 -3.81,3.81; 11 -6.35,3.81; 12 -8.89,3.81
AK500/2-H = drill 1.321 long: 1 -2.515,0; 2 2.515,0

### Placement (x,y rotation side)
ACT  63.11,3.52 180 top
C1  64.13,10.63 0 top
C2  64.13,15.71 0 top
C3  64.13,18.25 0 top
C4  64.13,20.79 180 top
C5  34.41,54.32 0 top
C6  22.98,26.38 180 top
C7  28.32,54.32 180 top
C8  30.09,27.65 0 bottom
C9  33.4,27.65 180 bottom
C10  55.49,66.76 270 top
C11  60.32,60.16 90 top
C12  66.67,49.24 90 bottom
C13  66.67,52.54 270 bottom
C14  64.13,13.17 180 top
C15  48.48,41.62 90 bottom
C16  48.48,48.43 270 bottom
C17  61.13,22.39 180 bottom
C18  57.81,22.36 0 bottom
C24  53.46,51.02 0 bottom
C25  55.24,37.5 90 bottom
C26  58.08,37.55 270 bottom
C27  56.76,44.67 90 bottom
C28  2.41,42.63 270 bottom
C29  2.41,39.08 90 bottom
C30  42.54,57.11 180 top
C31  48.64,67.02 90 top
C32  48.64,60.41 270 top
C33  48.64,63.72 270 top
C34  36.7,59.91 90 top
C35  2.41,62.45 90 bottom
C36  2.41,58.89 90 bottom
C37  18.66,63.21 90 top
C38  25.27,56.86 180 top
C39  32.13,67.02 90 top
C40  32.13,60.41 270 top
C41  32.13,63.72 270 top
C42  20.7,59.91 90 top
CAN  26.03,4.28 0 top
CAN1  10.54,3.52 180 top
CAN2  15.87,3.52 180 top
COM  34.92,74.13 0 top
D2  65.4,73.62 0 top
ETH  51.43,10.63 0 top
F1  6.22,22.06 90 top
H1  74.29,4.28 0 top
H2  4.44,81.75 0 top
H3  4.44,4.28 0 top
H4  74.29,81.75 0 top
IC1  42.54,63.72 90 top
IC2  31.36,43.4 0 top
IC3  72.26,51.27 90 top
IC4  14.6,44.92 270 top
IC5  26.03,18.25 180 top
IC8  12.06,63.21 0 top
IC9  26.28,63.72 90 top
ISP  37.46,8.09 270 top
ISP_48  13.08,77.94 90 top
JTAG  15.87,28.41 90 top
KK1  69.97,51.27 90 top
LINK  67.69,3.52 180 top
POWER  53.72,83.27 0 top
Q1  31.62,30.19 180 top
Q2  59.3,25.11 0 top
Q3  4.44,41.11 270 top
Q4  4.19,60.67 90 top
R1  75.56,21.04 270 bottom
R2  23.24,31.46 0 top
R3  23.24,28.92 0 top
R4  36.19,22.57 180 top
R5  36.19,20.28 180 top
R6  36.19,17.74 180 top
R7  53.72,79.21 0 top
R8  17.65,55.08 90 top
R9  12.82,55.08 90 top
R10  45.33,23.84 270 top
R11  47.87,23.84 270 top
R12  42.79,23.84 270 top
R13  50.41,23.84 90 top
R14  15.11,55.08 90 top
R15  10.79,7.07 0 top
R16  67.94,6.82 180 top
R17  63.62,6.82 0 top
R18  16.12,7.07 180 top
R20  19.43,18.5 90 top
RTL  52.7,43.65 270 top
U$2  71.75,20.79 90 top
X2  62.86,81.75 180 top

### Tracks (layer width: path | path; a pad name or v marks a point on that pad's centre or on a via)
A0  (via drill 0.7)
  Top 0.406: RTL.5 45.84,50.48 v46.86,51.27 | IC2.35 35.17,39 v35.17,39.08
  Bottom 0.406: v35.17,39.08 33.65,40.6 33.65,44.92 38.22,49.49 39.49,49.49 40.25,50.25 45.84,50.25 v46.86,51.27
A1  (via drill 0.7)
  Top 0.406: RTL.7 41.02,49.18 v40.76,49.24 | IC2.36 35.98,39.8 v34.67,41.11
  Bottom 0.406: v34.67,41.11 34.67,44.92 38.48,48.73 40,48.73 40.51,49.24 v40.76,49.24
A2  (via drill 0.7)
  Top 0.406: RTL.8 46.55,48.53 v46.86,48.22 | IC2.37 36.7,40.6 v36.44,40.86
  Bottom 0.406: v36.44,40.86 35.43,41.87 35.43,44.67 38.73,47.97 40.25,47.97 40.51,48.22 v46.86,48.22
A3  (via drill 0.7)
  Top 0.406: 37.43,41.4 IC2.38 | v36.44,43.65 36.44,42.38 37.43,41.4 | 37.46,41.36 37.43,41.4 | RTL.9 41.02,47.88 v41.02,47.21
  Bottom 0.406: v36.44,43.65 36.44,44.67 38.98,47.21 v41.02,47.21
A4
  Top 0.406: IC2.39 42.03,42.2 42.03,47.21 43.56,47.21 43.56,47.23 RTL.10
A5  (via drill 0.7)
  Top 0.406: IC2.40 37.71,43 v37.71,42.89 | RTL.29 42.17,34.88 41.78,35.27 v41.78,39.84
  Bottom 0.406: v37.71,42.89 37.71,39.84 v41.78,39.84
A6  (via drill 0.7)
  Top 0.406: IC2.41 40.76,43.8 v40.76,43.4 | RTL.30 41.75,34.23 40.76,35.21 40.76,36.28 40.73,41.08 v40.76,41.11
  Bottom 0.406: v40.76,41.11 v40.76,43.4
A7  (via drill 0.7)
  Top 0.406: IC2.42 37.71,44.6 v37.71,44.41 | RTL.33 47.83,37.76 v48.13,37.81
  Bottom 0.406: v48.13,37.81 43.05,37.81 43.05,44.41 v37.71,44.41
A8  (via drill 0.7)
  Top 0.406: IC2.32 37.36,34.35 41.27,30.44 v41.27,30.19 | R12.2 42.79,23.08 v41.27,23.08
  Bottom 0.406: v41.27,23.08 v41.27,30.19
A9  (via drill 0.7)
  Top 0.406: IC2.31 36.56,34.13 39.75,30.95 v39.75,30.19 | R10.2 45.33,21.55 41.27,21.55 v39.75,23.08
  Bottom 0.406: v39.75,23.08 v39.75,30.19
A10  (via drill 0.7)
  Top 0.406: IC2.9 27.55,43 29.84,40.71 v29.84,37.3 | RTL.4 41.92,51.12 v41.78,51.27
  Bottom 0.406: v41.78,51.27 41.78,51.02 40,51.02 39.24,50.25 35.68,50.25 34.16,48.48 33.14,48.48 32.63,47.97 31.62,47.97 31.11,47.46 31.11,46.44 30.6,45.94 30.6,38.06 v29.84,37.3
CAN_INT  (via drill 0.7)
  Top 0.406: v17.39,42.38 IC4.12 | 25.01,44.16 v25.01,44.05 25.01,43.8 IC2.8
  Bottom 0.406: v17.39,42.38 22.98,42.38 v25.01,44.05
CS
  Top 0.406: IC4.16 21.2,47.46 22.22,46.44 22.22,42.2 IC2.10
D0  (via drill 0.7)
  Top 0.406: IC2.51 35.76,51.27 35.68,51.27 35.68,52.03 37.46,53.81 38.22,53.81 v38.73,54.32 | RTL.36 49.77,34.51 v48.89,34.51
  Bottom 0.406: v38.73,54.32 38.98,54.57 55.49,54.57 55.49,49.49 53.72,49.49 53.72,34.51 v48.89,34.51
D1  (via drill 0.7)
  Top 0.406: IC2.50 36.56,51.9 37.21,52.54 v37.97,52.54 | RTL.37 50.43,35.52 v49.91,35.52
  Bottom 0.406: v37.97,52.54 38.48,52.54 39.75,53.81 48.89,53.81 51.43,51.52 51.43,48.48 52.95,48.48 52.95,35.52 v49.91,35.52
D2  (via drill 0.7)
  Top 0.406: IC2.49 38.4,51.2 v38.48,51.27 | RTL.38 51.08,36.79 49.91,36.79 v49.65,37.05
  Bottom 0.406: v38.48,51.27 38.48,51.52 40,53.05 48.38,53.05 50.67,50.76 50.67,47.71 52.19,47.71 52.19,36.79 49.91,36.79 v49.65,37.05
D3  (via drill 0.7)
  Top 0.406: IC2.48 39.16,49.42 40.51,50.76 v40.51,52.03 | RTL.39 51.73,37.81 v50.92,37.81
  Bottom 0.406: v40.51,52.03 40.76,52.29 47.87,52.29 49.91,50.25 49.91,46.95 51.43,46.95 51.43,38.32 v50.92,37.81
D4  (via drill 0.7)
  Top 0.406: IC2.47 35.82,48.6 v35.43,48.22 | RTL.40 52.38,30.37 v51.68,29.68
  Bottom 0.406: v35.43,48.22 35.43,47.71 32.89,45.17 32.89,39.59 34.41,38.06 37.71,38.06 43.3,32.47 51.68,32.47 v51.68,29.68
D5  (via drill 0.7)
  Top 0.406: v50.41,28.66 52.19,28.66 53.02,29.5 RTL.41 | IC2.46 37.8,47.8 37.21,47.21 33.9,47.21 v33.65,47.46
  Bottom 0.406: v33.65,47.46 33.65,46.95 32.13,45.43 32.13,39.33 34.16,37.3 37.46,37.3 43.3,31.46 50.41,31.46 v50.41,28.66
D6  (via drill 0.7)
  Top 0.406: v51.43,27.65 52.19,27.65 53.68,29.13 RTL.42 | IC2.45 38.01,47 37.46,46.44 32.63,46.44 v32.13,46.95
  Bottom 0.406: v51.43,27.65 49.4,27.65 49.4,30.44 43.3,30.44 37.21,36.54 33.9,36.54 31.36,39.08 31.36,45.68 32.13,46.44 v32.13,46.95
D7  (via drill 0.7)
  Top 0.406: IC2.44 40.25,46.2 v40.76,45.68 | RTL.43 54.33,33.64 53.46,34.51 53.46,43.9 v49.14,43.9
  Bottom 0.406: v40.76,45.68 41.27,45.17 46.86,45.17 46.86,43.9 v49.14,43.9
GND  (via drill 0.7)  (6 unrouted)
  Top 0.254: 50.41,55.59 49.91,55.59 RTL.95 | RTL.90 52.95,55.59 52.45,55.59 RTL.91 52.45,56.6 52.45,57.87 | 52.38,54.57 51.68,54.57 RTL.92 51.68,55.59 51.18,55.59 RTL.93 50.92,55.59 50.41,55.59 | 50.41,55.59 RTL.94 | RTL.28 43.81,35.52 43.81,36.03 RTL.27 43.81,36.28 | 43.81,37.55 RTL.25 | 43.81,36.79 RTL.26 | 54.99,55.59 54.48,55.59 RTL.88 | 54.99,55.59 55.49,55.59 RTL.86 55.75,56.6 55.75,57.87 | 54.99,55.59 RTL.87 | 61.59,35.52 61.59,35.01 RTL.52 | 43.81,39.33 RTL.22 43.81,39.59 | IC2.59 29.33,51.27 28.82,51.27 IC2.60 28.32,51.27 27.81,51.27 IC2.61 | 49.91,57.87 49.65,57.87 | RTL.56 60.57,37.55 60.07,37.05 v59.81,36.54 60.32,36.28 60.57,36.28 RTL.54 61.59,36.03 61.59,35.52 | RTL.18 43.81,41.87 43.81,41.36 RTL.19 | 43.81,40.09 RTL.21 | 61.59,35.52 RTL.53 | 43.81,38.06 RTL.24 | 43.81,38.82 RTL.23 | ISP.4 39.24,10.63
  Top 0.406: C37.2 18.66,64.22 18.05,63.61 IC8.21 12.68,63.61 11.81,64.48 v9.52,64.48 7.77,64.48 IC8.3 7.56,64.41 7.49,64.48 6.98,64.48 6.73,64.22 6.73,62.95 6.87,62.81 IC8.5 | IC9.11 24.63,65.62 27.17,68.16 IC9.8 30.86,68.16 | C39.2 31.96,67.87 31.87,67.78 31.49,68.16 30.86,68.16 | C34.2 36.7,60.92 37.08,60.54 | 39.24,60.41 39.37,60.54 IC1.15 | IC2.53 34.16,53.3 33.65,53.81 33.65,54.06 33.4,54.32 C5.1 | C7.1 29.17,54.23 29.36,54.03 IC2.59 | RTL.91 52.38,54.57 52.38,52.98 v52.19,52.79 | C37.2 18.66,63.97 | COM.6 30.86,75.4 30.86,68.16 | C37.2 18.83,64.06 19.68,63.21 19.68,61.68 20.61,60.76 C42.2 20.86,60.76 21.08,60.54 IC9.15 23.36,60.54 23.49,60.41 24.76,60.41 25.01,60.16 25.01,58.89 24.42,58.04 C38.2 24.25,56.86 | v46.86,46.7 arc-90 46.73,46.58 RTL.11 43.73,46.01 43.81,45.94 43.8,45.93 RTL.12 | v46.6,40.6 46.48,40.73 | v55.24,34.51 54.98,34.51 RTL.44 54.98,31.7 54.99,31.71 54.99,29.43 51.94,26.38 51.94,22.99 | RTL.55 59.81,36.83 v59.81,36.54 | RTL.64 58.8,42.68 v58.8,43.65 | 43.73,45.5 43.81,45.43 43.73,45.35 RTL.13 43.73,44.74 43.81,44.67 43.77,44.62 RTL.14 | 63.37,18.25 63.37,20.79 C4.2 63.28,19.01 v61.34,19.01 | 63.37,18.25 C3.1 | 63.37,18.25 63.37,15.71 | C14.2 63.37,13.17 63.37,15.71 | 63.37,15.71 C2.1 | 51.94,22.99 R13.1 | 51.94,22.99 53.55,22.99 v54.48,22.06 | 38.73,10.88 38.98,10.63 39.24,10.63 41.52,10.63 41.52,20.79 50.41,20.79 50.41,22.82 | RTL.83 57.58,57.87 v57.53,57.87 | 29.33,55.59 29.33,54.32 29.33,56.1 | IC2.61 27.81,51.2 27.81,50 26.16,50 IC2.63 | 29.33,35.6 IC2.22 29.36,33.78 27.81,32.22 26.28,32.22 25.52,31.46 v25.52,30.44 | IC4.9 8,39.84 v8,38.57 | C6.1 25.52,26.38 v25.78,26.63
  Top 0.406: IC5.8 29.59,14.19 29.59,1.49
  Top 0.813: 37.08,60.54 IC1.15 | C30.2 41.69,59.74 41.02,60.41 39.24,60.41 | 48.8,68.03 C31.2 | 48.8,68.03 52.45,68.03 C10.- 59.3,61.18 | 59.3,61.18 C11.- | 46.48,40.73 43.81,40.73 | 43.81,40.73 RTL.20 | RTL.12 43.73,45.5 | 3.17,1.46 20.7,1.49 | 20.7,1.49 20.78,1.49 CAN.1 14.6,15.71 JTAG.2 | H1.B3,0 74.29,1.49 59.81,1.49 | 20.7,1.49 29.59,1.49 38.73,1.49 | 38.73,1.49 43.05,1.49 | 43.05,1.49 59.81,1.49 | ETH.G1 43.05,6.06 43.05,1.49 | 59.81,1.49 ETH.G2 | 47.37,74.13 COM.G2 48.64,74.13 | 48.8,68.03 48.8,74.13 48.64,74.13 | 52.87,77.43 52.87,74.13 48.64,74.13 | 52.87,77.43 R7.1 | X2.2 60.34,77.43 52.87,77.43 | ISP.4 ISP.6 ISP.8 | ISP.8 ISP.10 | 38.73,1.49 ISP.8 | v59.81,36.54 58.54,36.54 58.54,39.84 56.51,41.87 56.51,43.65 56.76,43.65 | v58.8,43.65 56.76,43.65 | 59.3,61.18 57.53,59.4 v57.53,57.87 55.75,57.87 52.45,57.87 49.91,57.87 | v50.41,45.43 54.73,45.43 54.73,43.65 56.76,43.65 | 49.65,57.87 44.57,57.87 44.57,55.84 41.52,55.84 41.52,56.86 | 33.4,56.1 33.4,54.32 | 33.4,56.1 35.17,56.1 35.17,60.67 36.7,60.67 C34.2 | 29.33,54.32 C7.1 | 29.33,55.59 24.25,55.59 24.25,56.86 | 29.33,56.1 33.4,56.1 | 43.81,36.28 43.81,36.79 43.81,37.55 43.81,38.06 43.81,38.82 43.81,39.33 | 43.81,40.73 43.81,40.09 43.81,39.59 | 43.81,40.73 43.81,41.36
  Bottom 0.406: 31.62,27.65 C8.1 | 31.62,27.65 C9.1 | C17.1 60.24,22.39 60.07,22.57 59.86,22.36 59.56,22.36 | 59.56,22.36 C18.1 | C24.2 52.19,51.02 v52.19,52.79 | 30.86,75.4 32.13,76.67 34.16,76.67 34.92,75.91 | 34.92,75.91 COM.3 | COM.9 37.77,76.67 35.68,76.67 34.92,75.91 | C16.2 48.48,46.7 48.38,46.7 | 46.77,40.77 v46.6,40.6 | v59.81,36.54 59.81,36.7 C26.2 58.09,33.49 55.24,33.49 v55.24,34.51 C25.1 | v58.8,43.65 58.8,43.82 | 30.86,75.4 COM.6 | 30.86,84.54 30.86,75.4 | 2.41,40.86 C29.2 2.41,41.11 | 2.41,41.11 C28.2 | 8,67.02 1.39,67.02 1.39,60.67 2.41,60.67 | 8,64.48 v9.52,64.48 | 48.48,40.86 C15.1 | v54.48,22.06 55.49,21.04 59.56,21.04 | 59.56,21.04 59.56,22.36 | v61.34,19.01 59.56,20.79 59.56,21.04 | JTAG.10 11.3,33.49 11.3,23.33 JTAG.2 | 28.57,26.63 v25.78,26.63 | 31.62,26.63 28.57,26.63 | 31.62,26.63 31.62,27.65 | v25.52,30.44 25.52,29.68 28.57,26.63 | IC5.8 32.13,16.73 34.67,16.73 34.67,26.63 31.62,26.63 | H4.B3,0 71.75,84.29 62.89,84.29 X2.2 | 2.41,60.67 C36.2 | 2.41,60.67 C35.1 | 2.41,41.11 1.39,40.09 1.39,35.52 1.65,35.27 2.15,35.27
  Bottom 0.813: v46.86,46.7 48.38,46.7 48.38,45.43 v50.41,45.43 50.41,40.86 48.48,40.86 | C15.1 46.77,40.77 | 58.8,43.82 C27.1 | IC3.GND 66.67,51.27 C13.2 C12.2 66.67,50 65.15,50 65.15,43.65 64.89,43.65 | 22.4,84.54 11.81,84.54 ISP_48.10 | 22.4,84.54 COM.G1 | COM.G2 47.37,74.13 47.37,84.54 30.86,84.54 22.4,84.54 | 8,81.75 H2.B3,0 | 8,81.75 8,67.02 8,64.48 v8,38.57 8,35.27 2.15,35.27 2.15,5.3 | ISP_48.10 8,83.02 8,81.75 | ISP_48.10 ISP_48.8 ISP_48.6 ISP_48.4 | ETH.G1 43.05,6.06 | 64.89,43.65 v58.8,43.65 | 64.89,43.65 74.8,43.65 74.8,32.47 72.26,32.47 72.26,4.53 74.29,4.53 H1.B3,0 | v57.53,57.87 62.1,57.87 65.15,54.83 65.15,50.25 | JTAG.2 14.6,20.03 25.52,20.03 27.3,21.81 IC5.2
  other vias: 41.78,62.19 38.22,57.62 13.08,71.34 9.27,52.79 64.13,44.67 57.53,48.98 49.4,38.82 41.78,71.34 44.83,19.27 38.22,27.65 33.65,33.49 1.9,55.08 1.65,65.75 1.65,46.19 1.9,35.52 54.73,25.11 64.13,25.36 64.13,29.17 61.59,66 27.81,17.49 57.02,40.35 13.84,47.46 16.63,46.19
  pour Top (isolate 0.254): 0.07,86.12 78.71,86.12 78.71,-0.04 0.07,-0.04
  pour Bottom (isolate 0.254): 0.07,86.12 78.71,86.12 78.71,-0.04 0.07,-0.04
MISO  (via drill 0.7)
  Top 0.406: IC4.15 20.95,46.19 21.46,45.68 v21.46,39.84 21.46,39.8 IC2.13 | v31.11,17.74 R6.2
  Bottom 0.406: v31.11,17.74 31.11,24.09 30.6,24.6 18.92,24.6 18.41,25.11 18.41,26.89 21.46,29.93 21.46,33.24 16.63,38.06 16.63,39.84 v21.46,39.84
MISO_48
  Top 0.406: R14.2 15.11,56.1 14.86,56.1 IC8.16
MOSI  (via drill 0.7)
  Top 0.406: IC4.14 v17.39,44.92 16.38,44.92 13.58,42.13 v12.06,42.13 | IC2.12 25.52,40.6 v26.54,41.36 | R5.2 33.65,20.28 33.65,19.01 v29.08,19.01
  Bottom 0.406: v26.54,41.36 26.79,41.62 26.79,44.92 25.78,45.94 23.24,45.94 22.22,44.92 v17.39,44.92 | v29.08,19.01 14.35,19.01 10.54,23.08 10.54,34.51 12.31,34.51 13.58,35.78 12.06,37.3 v12.06,42.13
MOSI_48
  Top 0.406: IC8.15 14.06,57.62 12.82,57.62 R9.2
N$1
  Top 0.305: RTL.58 62.91,38.78 63.37,38.32 63.37,33.24 64.13,32.47 74.29,32.47 75.56,31.2 U$2.6
  Bottom 0.406: R1.2 73.53,20.19 73.53,29.68 U$2.6 75.81,29.68
N$2  (via drill 0.7)
  Top 0.406: v12.82,46.19 12.82,50 IC4.1
  Bottom 0.406: v12.82,46.19 12.82,43.65 13.08,43.4 13.08,37.81 14.09,36.79 14.6,36.79 15.87,35.52 15.87,32.98 15.11,32.22 12.57,32.22 12.57,24.6 15.11,24.6 15.87,23.84 15.87,22.06 19.93,22.06 21.71,23.84 28.06,23.84 IC5.1
N$3
  Top 0.305: RTL.59 63.02,39.43 63.88,38.57 63.88,33.49 64.38,32.98 76.07,32.98 77.34,31.71 77.34,25.62 76.32,24.6 U$2.4
  Bottom 0.406: R1.1 U$2.4
N$4  (via drill 0.7)
  Top 0.406: U$2.3 77.34,15.2 77.34,11.14 76.07,9.87 67.69,9.87 67.18,9.36 64.13,9.36 63.28,10.21 C1.1 60.57,10.63 60.57,13.68 v53.21,13.68 | RTL.46 56.27,29.68 v57.53,29.68
  Bottom 0.406: v57.53,29.68 54.99,29.68 51.94,26.63 51.94,19.01 53.21,17.74 v53.21,13.68
N$5
  Top 0.406: C7.2 27.47,54.23 26.96,53.73 IC2.62
N$6
  Top 0.406: Q1.1 34.16,30.19 30.96,33.38 IC2.24
  Bottom 0.406: Q1.1 34.16,30.19 34.25,30.1 C9.2
N$7
  Top 0.406: Q1.2 29.33,30.19 30.16,31.02 IC2.23
  Bottom 0.406: Q1.2 29.2,30.06 29.33,29.93 29.24,29.85 C8.2
N$8
  Top 0.813: D2.C 55.49,71.34 C10.+
  Bottom 0.813: C12.1 66.76,48.39 66.92,48.22 67.43,48.73 IC3.IN 77.08,48.73 77.08,56.35 67.69,56.35 C10.+
N$9
  Top 0.406: IC1.7 45.74,67.02 47.11,67.02 47.11,69.05 44.32,69.05 44.06,69.3 44.06,72.1 38.48,77.69 31.36,77.69 29.33,75.65 29.33,73.11 29.59,72.86 COM.1
N$10
  Top 0.813: X2.1 65.38,81.27 D2.A
N$11  (via drill 0.7)
  Top 0.406: C1.2 v66.42,10.63 74.29,10.63 U$2.1 | RTL.45 55.62,28.66 v56.26,28.66
  Bottom 0.406: v56.26,28.66 54.99,28.66 52.7,26.38 52.7,22.06 54.48,20.28 54.48,19.01 56,17.49 56,14.44 60.57,14.44 60.57,10.63 v66.42,10.63
N$12
  Top 0.406: C3.2 71.5,18.25 72.77,19.52 72.77,25.62 74.04,26.89 75.31,26.89 U$2.5
N$13
  Top 0.406: C2.2 74.29,15.71 U$2.2
N$14
  Top 0.406: U$2.11 67.94,14.19 66.92,13.17 C14.1
N$15
  Top 0.406: C4.1 68.45,20.79 69.97,22.31 69.97,26.12 68.96,27.14 U$2.8
N$16
  Bottom 0.813: F1.1 15.95,10.81 20.19,6.57 31.36,6.57 31.36,9.53 | 31.36,9.53 31.36,9.61 | 31.36,9.53 CAN.4
N$17  (via drill 0.7)
  Top 0.406: v16.12,52.29 15.11,53.3 R14.1
  Bottom 0.406: v16.12,52.29 16.63,52.79 16.63,79.21 13.08,79.21 13.08,81.75 ISP_48.9
N$18
  Top 0.406: U$2.12 61.34,11.9 61.34,14.95 46.86,14.95 46.86,16.98 ETH.1-1
N$19  (via drill 0.7)
  Top 0.406: v61.34,16.98 61.34,15.71 48.38,15.71 48.38,19.52 ETH.1-2
  Bottom 0.406: v61.34,16.98 U$2.10
N$20
  Top 0.406: U$2.9 65.4,22.06 62.61,22.06 58.8,18.25 50.67,18.25 49.4,16.98 ETH.1-3
N$21  (via drill 0.7)
  Top 0.406: v13.84,44.16 11.81,44.16 11.81,48.73 IC4.2 | v19.17,23.33 20.44,22.06 IC5.4
  Bottom 0.406: v13.84,44.16 13.84,38.06 14.35,37.55 15.11,37.55 18.66,34 18.66,32.98 17.9,32.22 16.63,32.22 15.87,31.46 15.87,25.11 16.38,24.6 17.9,24.6 v19.17,23.33
N$22
  Top 0.406: R6.1 38.73,17.74 38.73,15.96 34.41,15.96 34.41,3.01 ISP.9
N$23
  Top 0.406: R20.1 20.86,16.22 22.98,16.22 IC5.6 22.73,12.41 22.73,7.84 24,6.57 26.03,6.57 27.78,8.32 CAN.3
N$24
  Top 0.406: U$2.7 65.91,27.65 65.91,23.58 65.15,22.82 62.35,22.82 60.07,20.79 54.73,20.79 53.46,19.52 ETH.1-6
N$25
  Top 0.406: ISP.1 36.19,14.69 39.49,14.69 39.49,19.01 38.22,20.28 R5.1
N$26  (via drill 0.7)
  Top 0.406: v20.44,30.44 20.44,28.92 R3.1 | IC2.1 24.35,49.4 25.27,48.48 v25.27,47.21
  Bottom 0.406: v25.27,47.21 15.62,47.21 15.62,39.59 15.87,39.33 15.87,37.81 20.44,33.24 v20.44,30.44
N$27
  Top 0.406: IC4.11 14.35,41.11 9.77,36.54 9.77,9.87 8,8.09 8,4.53 9.27,3.26 CAN1.K
N$28
  Top 0.406: R16.1 68.96,6.82 LINK.A
N$29
  Top 0.406: ISP.7 37.46,6.82 37.46,11.9 40.51,11.9 40.51,20.28 38.22,22.57 R4.1 36.95,22.57
N$30  (via drill 0.7)
  Top 0.406: v14.6,52.29 12.82,52.29 R9.1
  Bottom 0.406: v14.6,52.29 15.87,53.56 15.87,72.86 ISP_48.1 14.09,72.86
N$31
  Top 0.406: R7.2 54.57,79.46 54.99,79.46 POWER.K
N$32  (via drill 0.7)
  Top 0.406: IC2.58 30.16,54.83 v30.6,54.83
  Bottom 0.406: v30.6,54.83 26.54,54.83 24.25,52.54 18.92,52.54 18.41,53.05 18.41,70.07 52.45,70.07 POWER.A
N$33
  Top 0.406: COM.2 32.18,76.21 32.63,76.67 34.16,76.67 34.92,75.91 34.92,74.89 36.19,73.62 36.19,72.1 34.67,70.57 34.67,63.72 35.43,62.95 39.24,62.95 39.47,63.18 | 39.47,63.18 39.49,63.21 | 39.47,63.18 IC1.13
N$34
  Top 0.406: 61.92,25.18 61.72,24.98 Q2.2 61.59,25.11 59.81,28.41 59.81,32.98 61.05,34.23 RTL.51
  Bottom 0.406: Q2.2 61.72,24.98 61.98,24.71 C17.2
N$35
  Top 0.406: Q2.1 57.02,25.11 58.88,28.49 RTL.50
  Bottom 0.406: Q2.1 56.89,24.98 56.76,24.85 56.96,24.66 C18.2
N$36  (via drill 0.61, 0.7)
  Top 0.254: R10.1 44.83,25.11
  Top 0.406: R10.1 45.33,24.6 46.6,24.6 46.6,23.08 47.87,23.08 R11.2 | v60.83,30.95 v73.53,30.95 | v45.59,33.49 42.54,30.44 v42.54,29.43 | 44.83,25.11 v44.83,27.14 | RTL.77 63.51,51.12 65.4,49.24 65.4,46.7 v66.92,45.17
  Bottom 0.406: v73.53,30.95 75.81,30.95 75.81,44.16 74.8,45.17 v66.92,45.17 | v60.83,30.95 58.8,32.73 52.95,32.73 52.19,33.49 v45.59,33.49 | v44.83,27.14 v42.54,29.43
N$37  (via drill 0.61, 0.7)
  Top 0.254: 43.3,25.11 R12.1
  Top 0.406: v43.3,26.63 43.3,25.11 | v66.67,8.34 67.43,8.34 68.19,9.11 v77.08,9.11 | RTL.79 63.74,52.43 v68.7,47.46
  Bottom 0.406: v43.3,26.63 43.3,14.69 48.89,14.69 56,7.58 58.8,7.58 59.56,8.34 v66.67,8.34 | v68.7,47.46 77.34,47.46 77.34,9.36 v77.08,9.11
N$38  (via drill 0.7)
  Top 0.406: 19.93,39.84 IC4.10 14.09,39.84 10.54,36.28 10.54,8.6 v13.33,8.6
  Bottom 0.406: CAN2.K 13.33,4.79 v13.33,8.6
N$39
  Top 0.406: 50.41,24.6 R13.2 50.41,25.87 48.48,27.81 RTL.34
N$40  (via drill 0.7)
  Top 0.406: v17.65,52.29 R8.1
  Bottom 0.406: v17.65,52.29 17.65,80.48 ISP_48.7
N$44
  Top 0.406: R17.1 62.61,6.82 62.61,5.3 ACT.A
N$45  (via drill 0.7)
  Top 0.406: RTL.61 59.44,40.73 v57.78,42.38
  Bottom 0.406: LINK.K 66.42,5.3 70.99,9.87 70.99,31.71 67.43,35.27 67.43,42.38 v57.78,42.38
N$47  (via drill 0.7)
  Top 0.406: RTL.62 63.61,41.38 v63.62,41.36
  Bottom 0.406: v63.62,41.36 66.67,41.36 66.67,35.01 70.23,31.46 70.23,10.38 65.15,5.3 63.62,5.3 ACT.K
N$48
  Top 0.406: R15.1 9.94,5.38 CAN1.A
N$52
  Top 0.406: R18.1 16.97,6.91 16.89,6.82 17.14,6.57 CAN2.A
N$53
  Top 0.406: Q3.1 4.44,43.4 5.46,42.38 IC4.7
  Bottom 0.406: 2.57,43.48 C28.1 2.41,43.65 2.53,43.52 Q3.1
N$54
  Top 0.406: Q3.2 4.44,38.57 6.98,41.11 IC4.8
  Bottom 0.406: C29.1 2.41,38.06 3.04,38.7 Q3.2
N$59
  Top 0.406: R20.2 19.85,19.35 20.7,18.5 20.7,17.49 21.2,16.98 23.24,16.98 24,16.22 25.52,16.22 IC5.7 24.25,11.39 24.25,9.56 CAN.2
N$60
  Top 0.406: C32.2 48.64,59.4 48.51,59.27 IC1.1
N$61
  Top 0.406: C33.2 48.64,62.7 48.26,63.08 IC1.4
N$68  (via drill 0.7)
  Top 0.406: IC2.54 33.4,51.23 33.4,52.54 31.87,54.06 v32.13,54.57 | JTAG.9 18.16,33.49 v21.2,36.54
  Bottom 0.406: v32.13,54.57 31.87,53.81 27.3,53.81 27.3,49.24 27.55,48.98 27.55,39.59 24.76,36.79 21.46,36.79 v21.2,36.54
N$69  (via drill 0.7)
  Top 0.406: IC2.55 32.56,52.03 31.8,52.79 v31.36,52.79 | JTAG.3 20.19,25.87 v20.7,26.38
  Bottom 0.406: v31.36,52.79 31.36,48.73 30.35,47.71 30.35,46.7 29.84,46.19 29.84,38.82 23.74,32.73 23.74,26.38 v20.7,26.38
N$70  (via drill 0.7)
  Top 0.406: IC2.56 31.76,50.15 30.86,49.24 30.35,49.24 v30.09,48.98 | JTAG.5 17.14,29.17 18.66,30.7 18.66,31.71 21.2,34.25 22.73,34.25 v23.49,35.01
  Bottom 0.406: v30.09,48.98 29.59,48.48 29.59,47.46 29.08,46.95 29.08,39.08 25.01,35.01 v23.49,35.01
N$71  (via drill 0.7)
  Top 0.406: v28.57,49.24 28.57,50 30.6,50 30.96,50.36 IC2.57 | JTAG.1 17.14,18 v16.63,18 | v11.81,35.78 12.31,35.27 12.31,32.22 17.9,32.22 21.2,35.52 v22.22,35.52
  Bottom 0.406: v28.57,49.24 28.57,48.22 28.32,47.97 28.32,39.33 25.01,36.03 22.47,36.03 v22.22,35.52 | v16.63,18 7.74,18 7.74,29.68 9.77,31.71 9.77,36.03 11.55,36.03 v11.81,35.78
N$72
  Top 0.406: C33.1 48.64,64.73 48.26,64.35 IC1.5
N$73
  Top 0.406: C32.1 48.64,61.43 48.26,61.81 IC1.3
N$74
  Top 0.406: COM.7 33.65,75.4 33.65,62.45 34.29,61.81 IC1.14
N$75
  Top 0.406: COM.8 36.7,75.4 37.97,74.13 41.02,74.13 43.3,71.84 43.3,69.05 44.06,68.29 45.33,68.29 45.59,68.03 45.61,68.06 IC1.8
N$76
  Top 0.406: C30.1 43.39,59.74 44.06,60.41 46.1,60.41 45.97,60.54 IC1.2
N$77
  Top 0.406: C31.1 48.64,66 48.26,65.62 IC1.6
N$78  (via drill 0.7)
  Top 0.406: COM.4 37.66,72.05 35.68,70.07 v35.68,67.02 | IC9.7 27.68,66.89 v27.55,67.02
  Bottom 0.406: v27.55,67.02 v35.68,67.02
N$79
  Top 0.406: IC8.7 7.74,61.18 6.09,61.18 Q4.2
  Bottom 0.406: C35.2 2.41,63.46 3.8,63.46 Q4.2
N$80
  Top 0.406: IC8.8 6.35,60.41 Q4.1
  Bottom 0.406: C36.1 2.41,57.87 3.8,57.87 Q4.1
N$82  (via drill 0.7)
  Top 0.406: IC9.13 24.12,63.08 v26.79,65.75 | v36.7,65.75 36.7,69.81 39.75,72.86 COM.5
  Bottom 0.406: v26.79,65.75 v36.7,65.75
N$83
  Top 0.406: C40.2 32.13,59.4 32,59.27 IC9.1
N$84
  Top 0.406: C41.2 32.13,62.45 31.49,63.08 IC9.4
N$85
  Top 0.406: C41.1 32.04,64.57 31.87,64.73 31.49,64.35 IC9.5
N$86
  Top 0.406: C40.1 32.04,61.26 31.49,61.81 IC9.3
N$87
  Top 0.406: IC8.30 10.86,69.05 20.7,69.05 20.7,64.48 23.21,64.48 IC9.12
N$88
  Top 0.406: IC9.10 21.46,66.89 21.46,69.81 10.03,69.81 10.03,67.5 IC8.31
N$89
  Top 0.406: IC9.2 27.17,60.54 26.28,59.65 26.28,57.11 26.03,56.86 C38.1
N$90
  Top 0.406: C39.1 32.13,66 31.74,65.62 IC9.6
RST  (via drill 0.7)
  Top 0.406: IC2.20 27.76,34.46 27.3,34 24.51,34 | v32.89,14.44 32.89,16.22 26.79,16.22 26.03,16.98 24.25,16.98 23.49,17.74 23.49,24.6 22.22,24.6 22.22,26.38 C6.2 21.97,26.38 21.97,27.39 21.71,27.65 18.66,27.65 18.41,27.9 | JTAG.6 15.87,27.14 17.65,27.14 18.41,27.9 | IC8.29 11.66,65.75 v10.54,65.75 9.52,65.75 8.5,66.76 8.5,74.89 10.28,76.67 13.08,76.67 ISP_48.5 | v14.85,48.73 IC4.17 | v14.85,38.57 22.22,38.57 22.22,36.54 24.51,36.54 24.51,34 | 18.41,27.9 18.41,29.43 19.43,30.44 19.43,31.46 R2.1 22.39,31.62 22.22,31.71 24.51,34
  Bottom 0.406: v32.89,14.44 32.89,8.09 ISP.5 | v10.54,65.75 10.54,48.73 v14.85,48.73 v14.85,38.57
RXD  (via drill 0.7)
  Top 0.406: IC2.2 22.61,48.6 21.97,49.24 v21.97,57.87 | IC1.12 41.78,64.35 v41.78,64.22
  Bottom 0.406: v41.78,64.22 38.98,64.22 37.71,62.95 21.97,62.95 v21.97,57.87
RXD1  (via drill 0.7)
  Top 0.406: IC2.27 33.36,39.62 32.89,40.09 32.89,42.89 29.84,45.94 29.84,47.21 31.87,49.24 32.38,49.24 v32.89,49.75 | IC1.9 42.16,68.16 arc-90 v42.29,68.03
  Bottom 0.406: v32.89,49.75 32.89,53.3 33.4,53.81 33.4,55.08 32.63,55.84 24,55.84 23.74,55.59 20.19,55.59 19.43,56.35 19.43,69.3 42.29,69.3 v42.29,68.03
SCK  (via drill 0.7)
  Top 0.406: v16.89,43.65 IC4.13 | IC2.11 24.76,41.4 v25.27,41.9 | v32.89,22.57 R4.2
  Bottom 0.406: v16.89,43.65 22.47,43.65 24.51,45.17 25.52,45.17 26.03,44.67 26.03,43.14 25.27,42.38 v25.27,41.9 25.27,41.87 21.46,38.06 20.95,38.06 19.68,36.79 19.68,36.03 22.22,33.49 22.22,29.68 19.17,26.63 19.17,25.62 19.43,25.36 30.86,25.36 31.87,24.35 31.87,23.58 v32.89,22.57
SCK_48
  Top 0.254: IC8.17 16.89,60.41 | 17.65,60.41
  Top 0.406: 17.65,60.41 R8.2 | 16.89,60.41 17.65,60.41
SCL  (via drill 0.7)
  Top 0.406: IC8.28 12.46,65.35 v12.82,64.99 | IC2.25 31.76,36.65 31.11,37.3 31.11,40.6 27.81,43.9 26.54,43.9 v26.54,48.22
  Bottom 0.406: v12.82,64.99 12.82,59.65 12.31,59.14 12.31,50.51 23.24,50.51 25.52,48.22 v26.54,48.22
SDA  (via drill 0.7)
  Top 0.406: v23.49,51.52 25.52,49.24 27.05,49.24 27.81,48.22 27.81,44.92 31.87,40.86 31.87,37.55 32.56,36.86 IC2.26 | IC8.27 13.26,66.58 v13.84,66
  Bottom 0.406: v23.49,51.52 23.24,51.52 22.98,51.27 13.33,51.27 13.33,59.14 13.84,59.65 v13.84,66
TXD  (via drill 0.7)
  Top 0.406: IC2.3 21.88,47.8 21.2,48.48 21.2,51.27 20.7,51.27 v20.7,56.86 | IC1.10 38.35,66.89 37.97,66.51 37.97,65.24 v36.95,64.22
  Bottom 0.406: v36.95,64.22 20.7,64.22 v20.7,56.86
TXD1  (via drill 0.7)
  Top 0.406: IC2.28 34.16,40.09 33.65,40.6 33.65,43.4 31.11,45.94 31.11,47.46 31.62,47.97 32.63,47.97 33.14,48.48 34.16,48.48 35.43,50 38.22,50 38.48,50.25 38.98,50.25 39.49,50.76 39.49,53.3 39.75,53.56 v39.75,57.37 | IC1.11 43.05,65.62 v43.05,65.49
  Bottom 0.406: v39.75,57.37 43.05,60.67 v43.05,65.49
VCC  (via drill 0.7)
  Top 0.254: RTL.65 60.57,43.4 60.07,43.4 60.07,46.58 | 46.86,32.73 46.6,32.73 RTL.31 | RTL.32 47.11,31.71 46.86,31.71
  Top 0.406: 8.76,62.01 IC8.6 | 9.01,62.01 8.76,62.01 | 11.81,62.01 9.01,62.01 | 11.81,62.01 11.99,62.01 12.79,61.21 IC8.18 17.11,61.21 17.14,61.18 18.32,62.36 C37.1 | 36.7,58.89 36.95,58.64 37.59,59.27 IC1.16 | 24.25,31.46 25.78,32.98 27.55,32.98 28.56,33.99 IC2.21 28.57,35.52 | IC2.52 34.96,53.6 35.43,54.06 35.26,54.23 C5.2 36.7,55.75 v36.7,55.84 36.7,58.89 | IC8.4 8.61,63.61 9.01,63.21 9.01,62.19 8.76,61.94 8.76,62.01 | RTL.89 53.68,52.84 v53.72,52.79 53.72,51.52 | C37.1 18.66,62.45 | C37.1 18.66,60.92 20.44,59.14 20.44,58.89 20.61,59.06 C42.1 20.78,59.06 20.95,58.89 21.33,59.27 IC9.16 23.21,59.4 | RTL.6 46.78,49.83 v46.86,49.75 48.13,49.75 48.13,51.52 | RTL.47 56.93,34.51 v56.76,34.51 | RTL.57 59.81,38.12 v59.81,38.32 | RTL.70 60.07,46.58 58.8,46.58 58.8,46.95 | 58.8,46.95 v58.8,45.68 | 43.81,43.25 43.81,43.14 | RTL.15 43.81,43.9 43.81,43.25 | 43.81,43.25 RTL.16 | 43.81,43.25 43.81,42.75 RTL.17 43.73,42.63 v46.6,42.63 47.87,42.63 | R18.2 15.36,7.07 | R15.2 R18.2 | R18.2 15.27,8.69 14.09,9.87 12.06,9.87 v12.06,16.47 12.06,25.87 | 12.06,25.87 JTAG.4 | 11.81,62.01 v11.81,61.94 | 36.7,58.89 C34.1 | 48.13,46.95 58.8,46.95 | R11.1 47.87,26.12 47.11,26.89 47.11,31.71 47.14,31.68 RTL.32 | R17.2 64.38,6.82 | R17.2 R16.2 | R17.2 65.65,6.82 65.65,8.34 59.56,8.34 58.8,7.58 54.73,7.58 48.64,13.68 v43.81,13.68 | 24.25,31.46 R2.2 | 24.25,28.92 24.25,31.46 | 24.25,28.41 24.25,28.75 R3.2 24.25,28.92 | IC2.64 25.36,51.52 25.27,51.52 25.27,54.32 22.98,54.32 v22.98,56.86 22.96,55.84 22.96,59.4 23.21,59.4 | 23.21,59.4 23.24,59.4 | 8,46.19 IC4.4 | 8,51.27 8,59.14 9.01,60.16 9.01,62.01 | 8,51.27 8,46.19 | IC4.18 18.41,50 17.14,51.27 8,51.27
  Top 0.406: IC4.6 8,43.65 8,44.92 | 8,46.19 8,44.92 | 8,44.92 IC4.5 | JTAG.7 15.87,29.68 12.06,29.68 12.06,25.87 | 27.3,25.36 27.3,26.89 25.27,28.92 24.25,28.92
  Top 0.813: C11.+ 60.32,54.32 57.53,51.52 53.72,51.52 48.13,51.52 48.13,46.95 48.13,45.68 47.87,45.68 47.87,42.63 47.87,39.33 46.86,39.33 46.86,32.73 46.86,31.71 | RTL.31 40.2,25.36 v38.73,25.36 27.3,25.36 24.76,25.36 IC5.3 v24.76,18
  Bottom 0.254: C25.2 55.49,38.82 55.49,45.17 56.51,45.17 C27.2
  Bottom 0.406: v53.72,52.79 54.22,52.29 54.22,51.27 54.06,51.1 C24.1 | C16.1 48.48,49.75 v46.86,49.75 | C15.2 48.32,42.63 v46.6,42.63 | v59.81,38.32 59.81,38.4 C26.1 58.09,38.57 56.76,38.57 | C27.2 58.8,45.52 v58.8,45.68 | v11.81,61.94 ISP_48.2 | 38.73,13.68 ISP.2 | 38.73,13.68 v43.81,13.68 | 56.76,38.57 v56.76,34.51 | C25.2 55.24,38.57 56.76,38.57 | v38.73,25.36 38.73,13.68
  Bottom 0.813: 66.67,53.81 66.42,53.81 | 66.67,53.81 66.92,53.81 | 66.67,53.81 IC3.OUT | 66.67,53.81 C13.1 | 66.67,53.81 66.67,55.59 63.11,59.14 C11.+ 56.76,59.14 54.22,55.84 v36.7,55.84 36.7,56.86 v22.98,56.86 | F1.2 6.22,16.47 v12.06,16.47 23.24,16.47 v24.76,18

### Text on the board
tNames: 2 | 2 | 2 | 2 | 2 | 1 | 1 | 1 | 1 | 1 | 10 | 10 | 10 | 10 | 10 | F09 | F09 | F09 | F09 | F09 | X2 | X2 | X2 | X2 | X2 | 2,54 | 2,54 | 2,54 | 2,54 | 2,54 | D2 | D2 | D2 | D2 | D2 | 6 | 6 | 6 | 6 | 6 | 9 | 9 | 9 | 9 | 9 | ISP_48 | ISP_48 | ISP_48 | ISP_48 | ISP_48 | 1 | 1 | 1 | 1 | 1 | 1 | 1 | 1 | 1 | 1 | 5 | 5 | 5 | 5 | 5 | BY550 | BY550 | BY550 | BY550 | BY550 | IC3 | IC3 | IC3 | IC3 | IC3 | KK1 | KK1 | KK1 | KK1 | KK1 | SK104 | SK104 | SK104 | SK104 | SK104 | 10 | 10 | 10 | 10 | 10 | 1 | 1 | 1 | 1 | 1 | 1 | 1 | 1 | 1 | 1 | GND | 10 | 10 | 10 | 10 | 10